# EAGLE board YAZ180_V23 (EAGLE 6.6.0), part 1 of 2
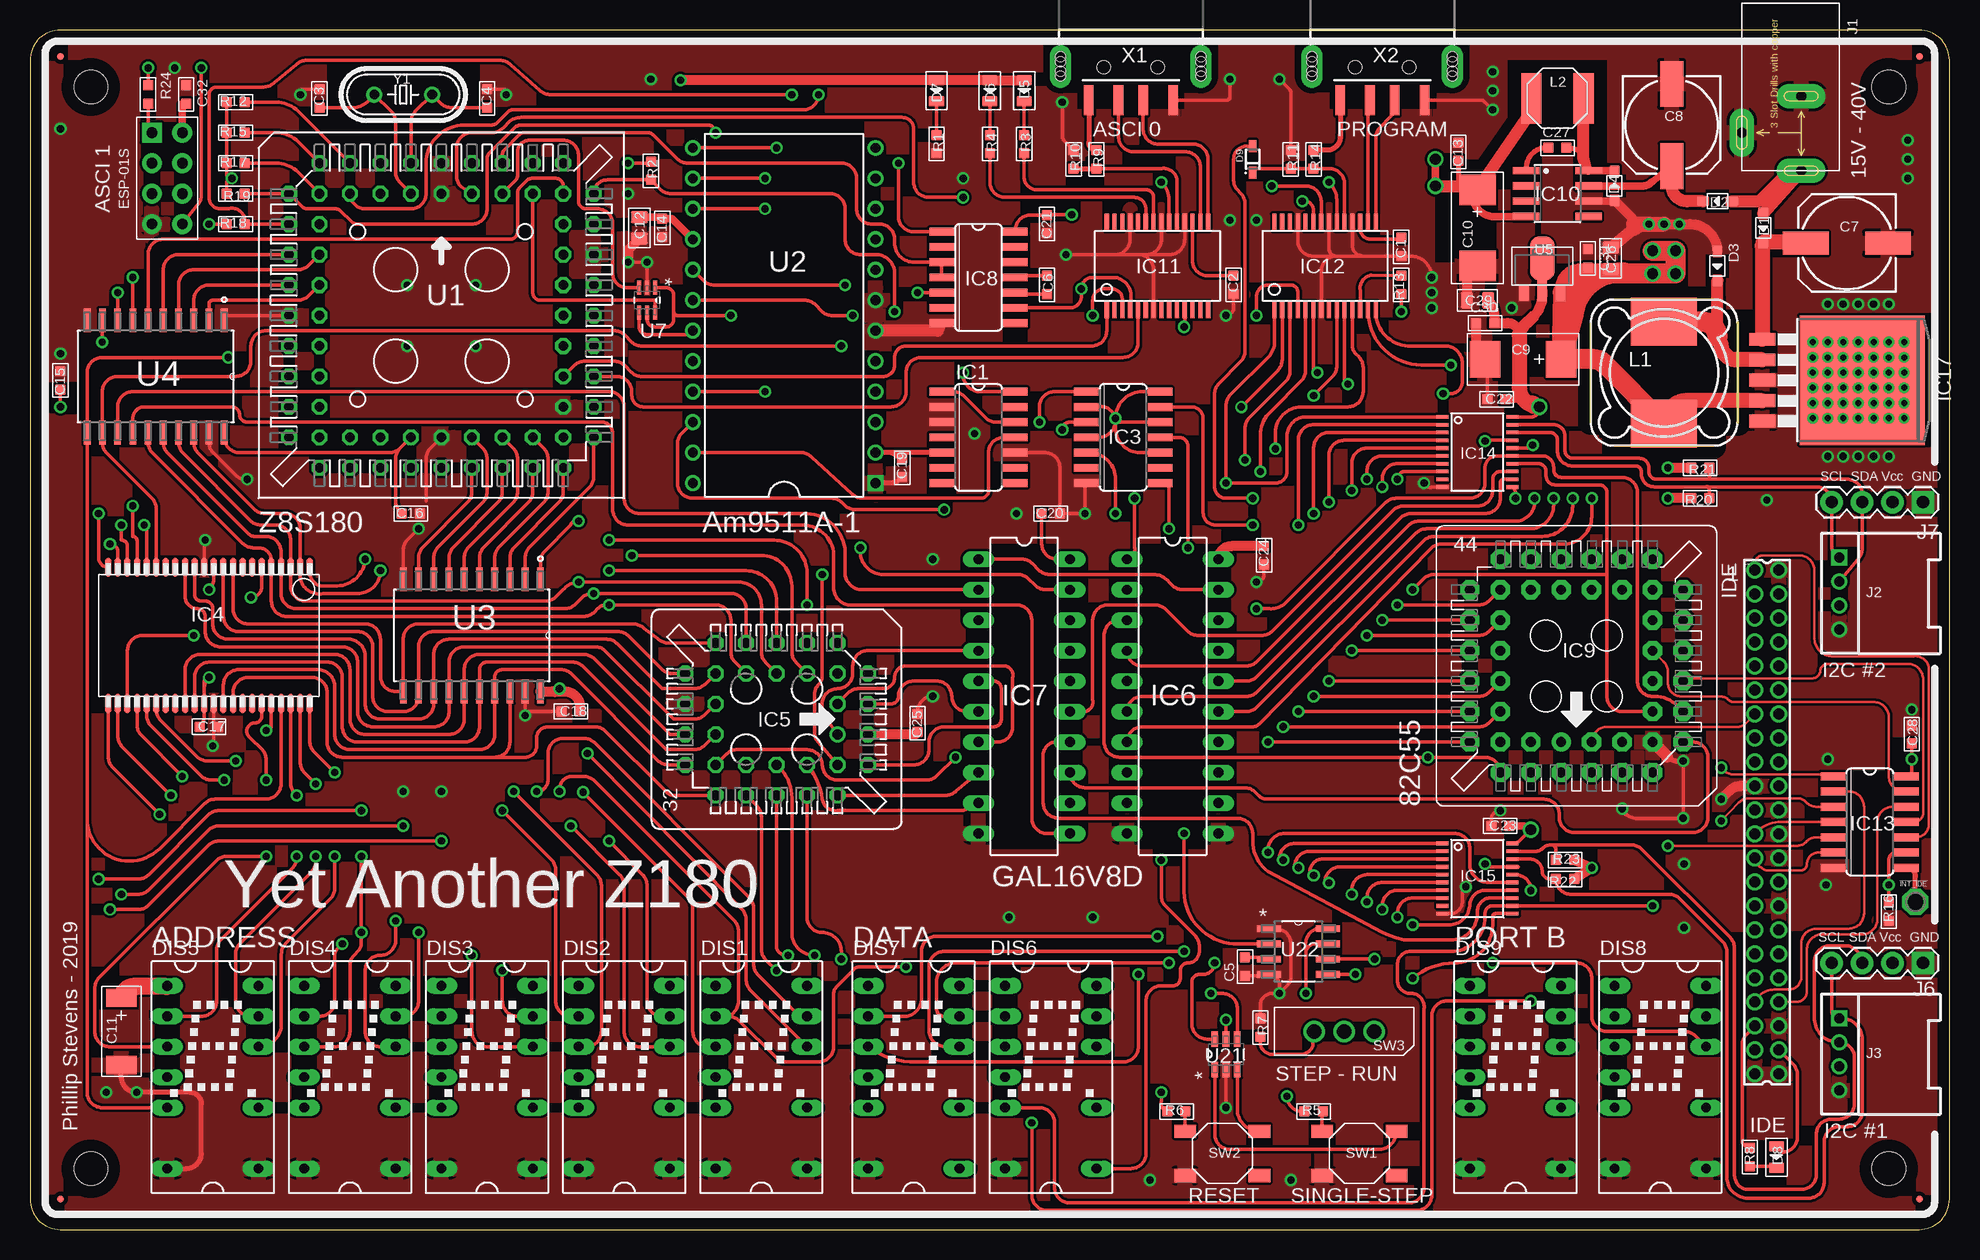
[diagram p7: board, top side]
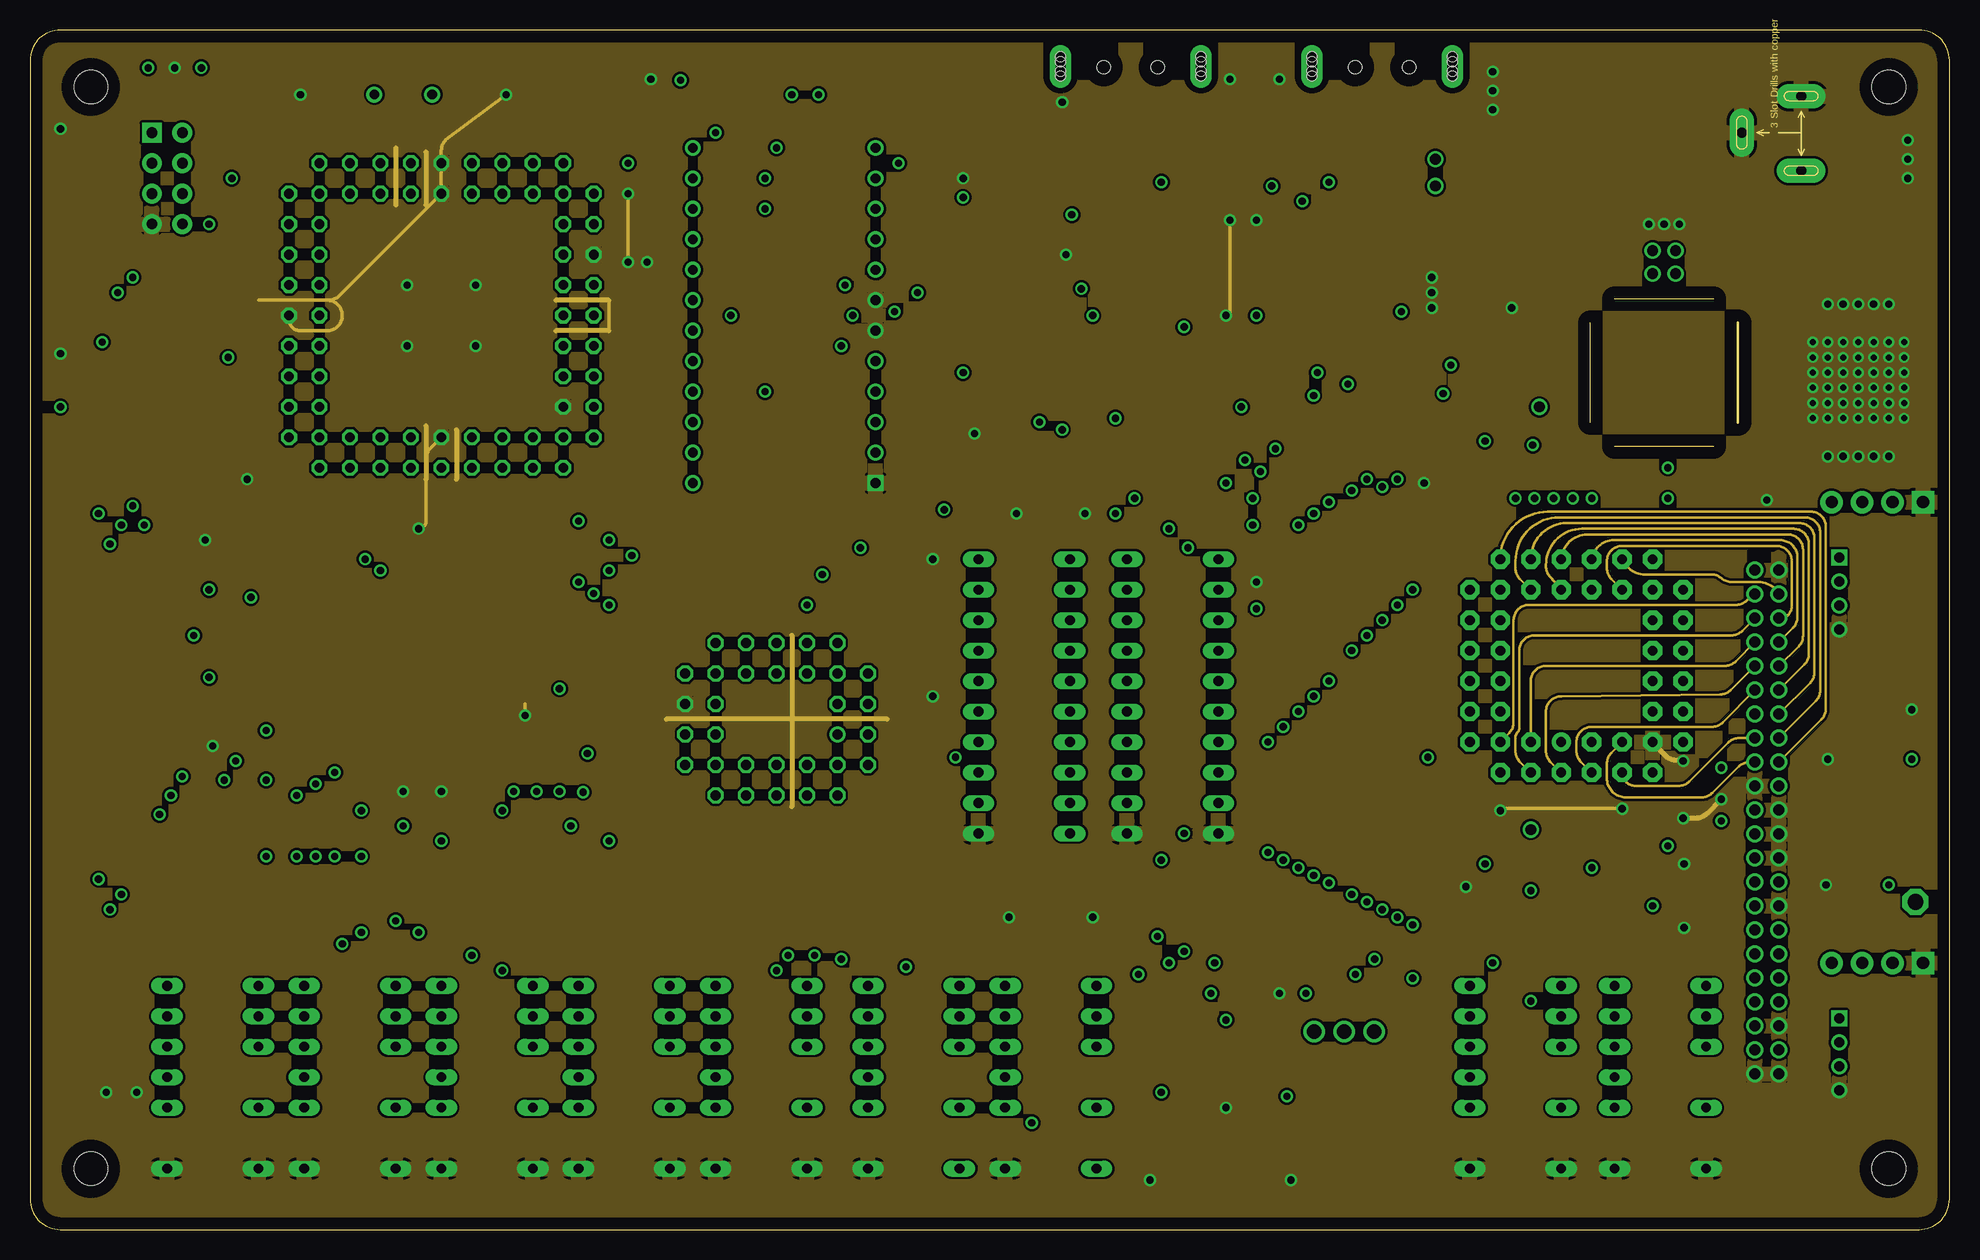
[diagram p8: board, inner layer $GND]
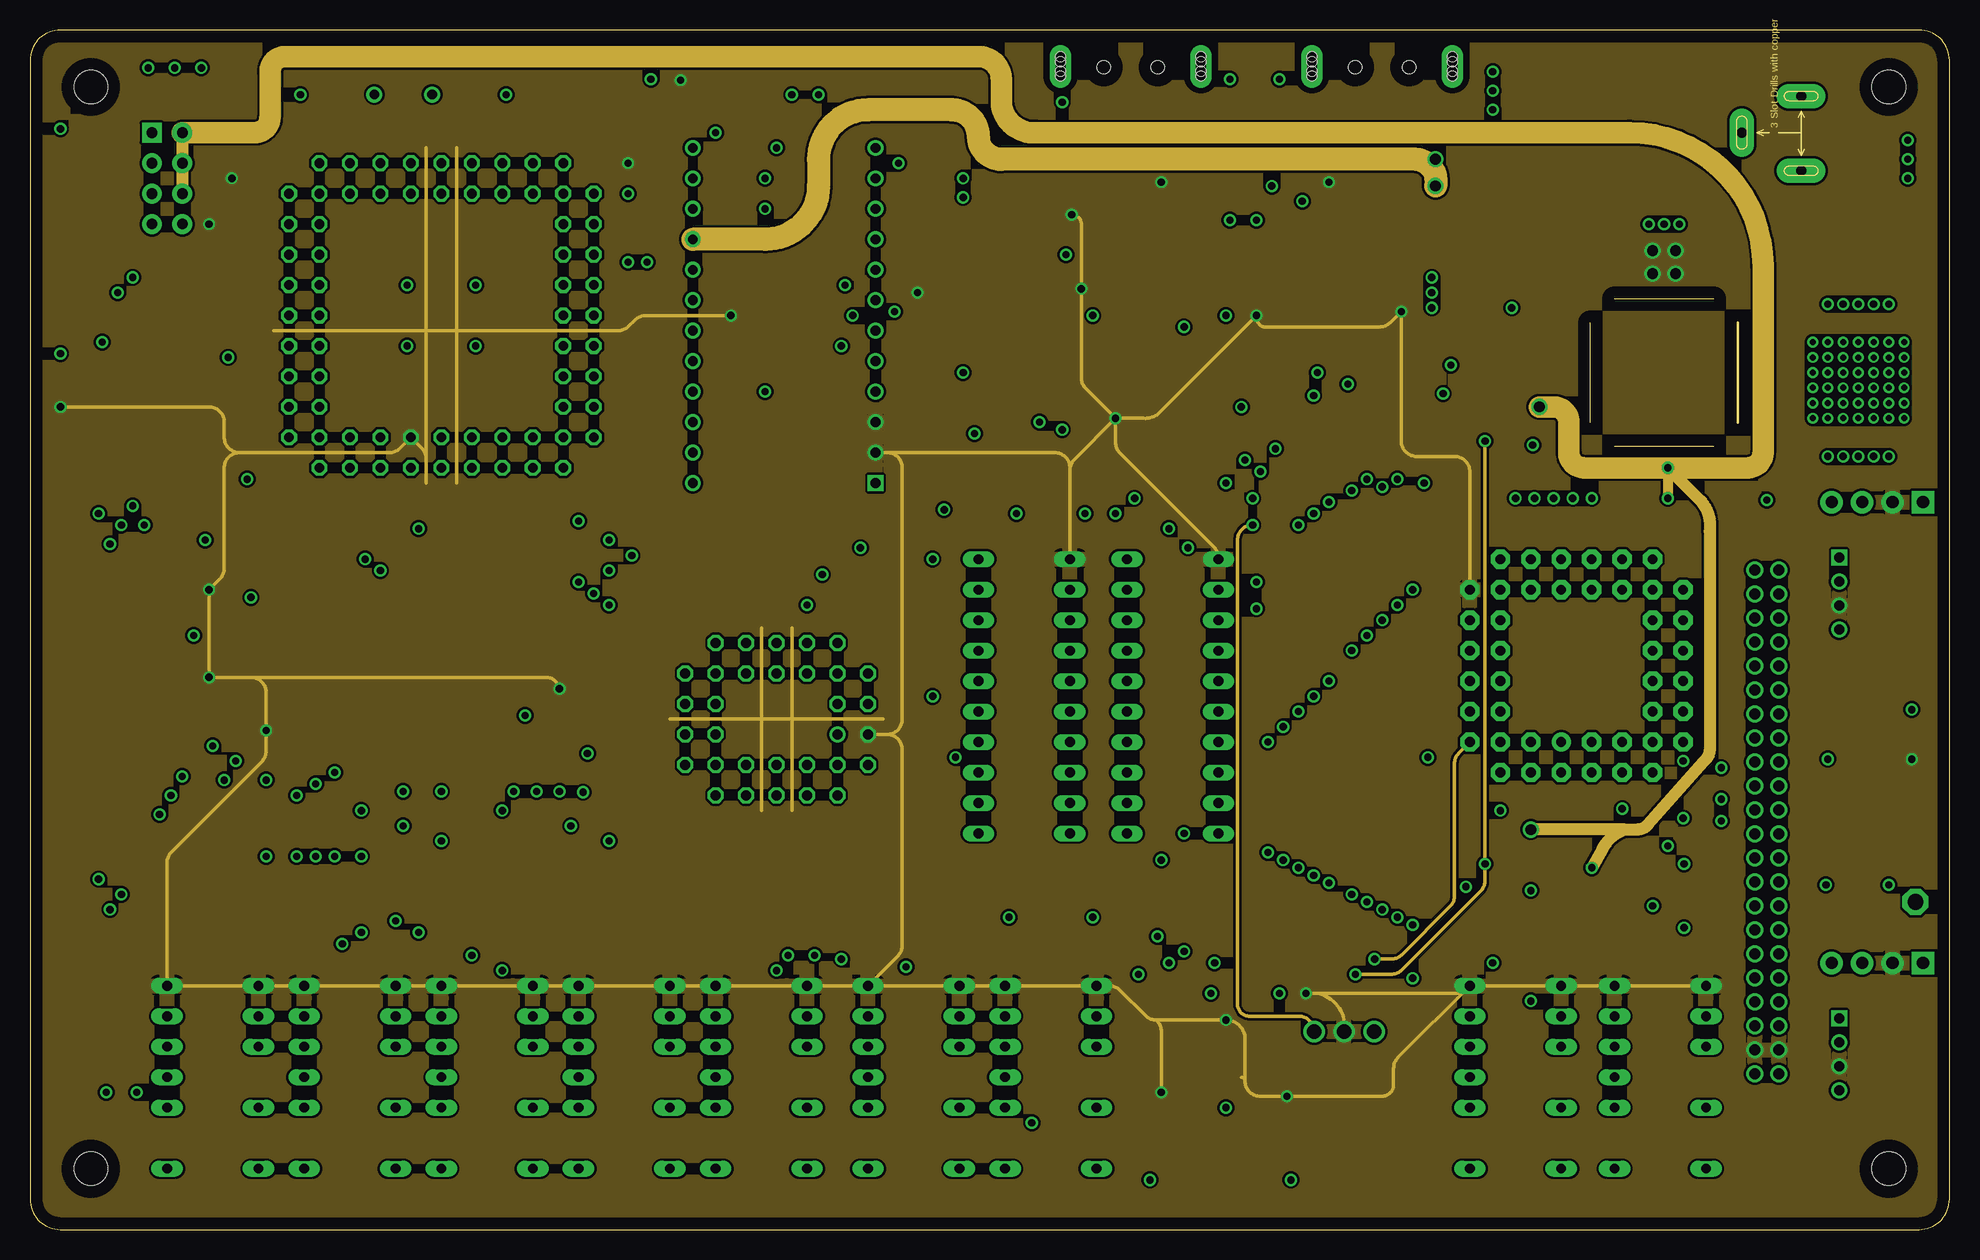
[diagram p9: board, inner layer $VCC]
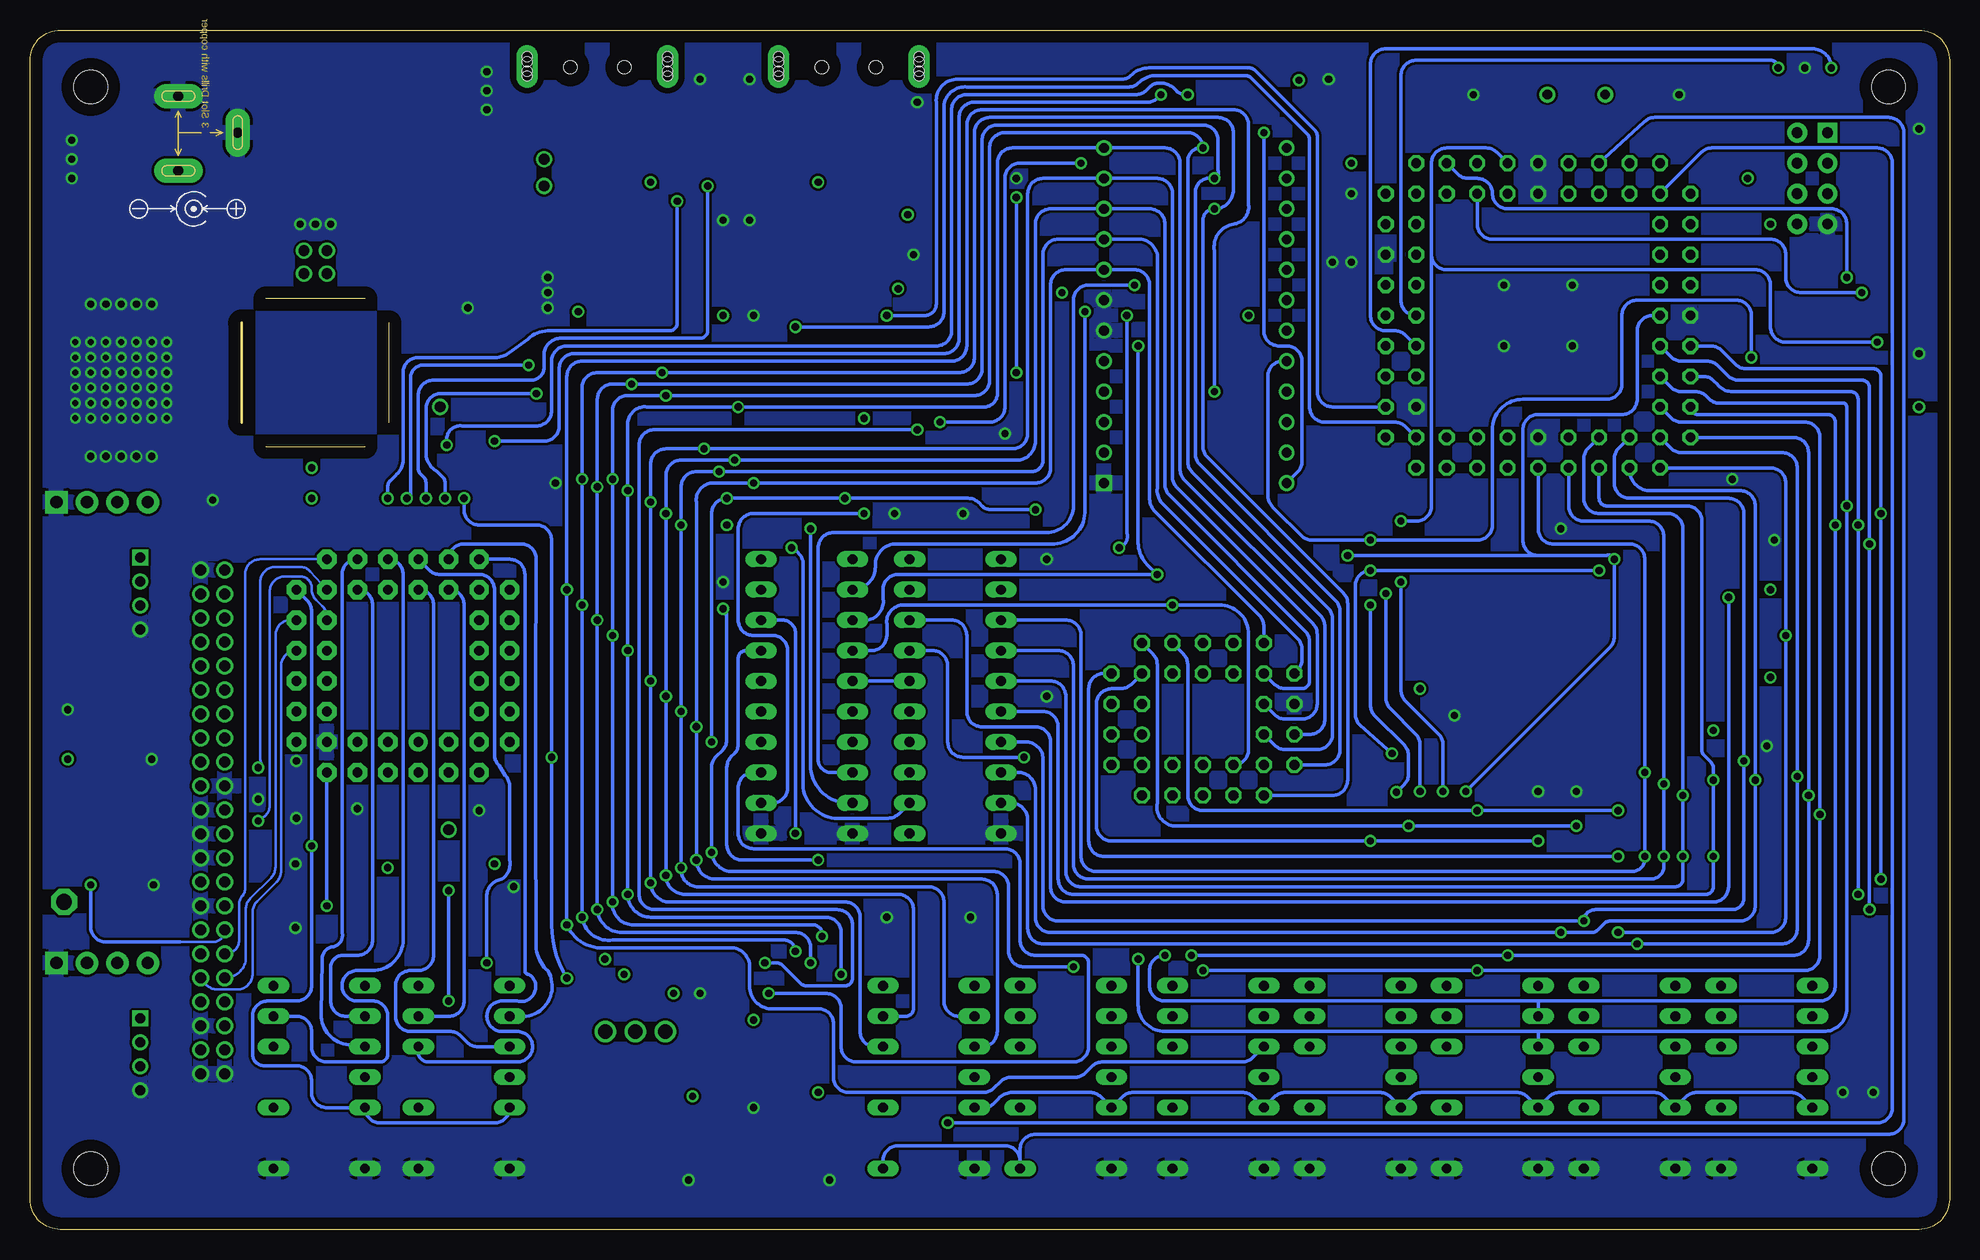
[diagram p10: board, bottom side, seen from below]

Size 160 x 100 mm. Coordinates in mm from the lower left corner, seen from the top.
Outline: 0,97.46 0,2.54 arc90 2.54,0 157.46,0 arc90 160,2.54 160,97.46 arc90 157.46,100 2.54,100 arc90 0,97.46
Copper layers (1*2*15*16): Top 0.035mm / dielectric 0.3mm / $GND 0.035mm / dielectric 0.3mm / $VCC 0.035mm / dielectric 0.3mm / Bottom 0.035mm
Design rules "default *": minimum track width 8mil, minimum drill 12mil, track to track 8mil, track to pad 8mil, pad to pad 8mil, via to via 10mil, smd to smd 8mil, copper to edge 40mil, drill to drill 8mil, minimum pad ring 10mil, minimum via ring 8mil, stop-mask expansion 4mil, vias tented up to drill 0mil, thermal gap 10mil
Holes 2.8 mm at 5.08,5.08 154.94,5.08 154.94,95.25 5.08,95.25
tRestrict: area 24.8,91.4 to 37.5,97.2; area 24.8,89.5 to 37.5,95.2; area 119.1,81.6 to 122.2,85.4; area 123.2,91.1 to 131.4,97.5; area 120.1,86.7 to 125.9,93.3; area 130.2,89.2 to 131.4,91.1; area 117.2,80.6 to 118.7,86; area 139.7,84.8 to 141.6,86.7; area 143.5,82.5 to 145.4,84.5; area 80,31.8 to 85.7,57.2; area 92.4,31.8 to 98.1,57.2; area 56.2,61 to 69.5,91.4; 13 more areas

## Footprints (pad centres in the part's own frame; a part is rotated, then mirrored left to right if it is on the bottom)
P1-13 = drill 1.321 pad 2.159 octagon: TP 0,0
C0603 = smd 0.889 x 0.889: 1 0,0.762; 2 0,-0.762
ELECTRO-SMD-E-7.8MM = smd 3.81 x 1.905: + 3.429,0; - -3.429,0
AVX-E = smd 2.54 x 3.048: + -3.175,0; - 3.175,0
AVX-C = smd 1.524 x 2.54: + -2.794,0; - 2.794,0
C0805 = smd 1.397 x 1.016: 1 0,0.889; 2 0,-0.889
SOD-323 = smd 1 x 0.8: + -1.2,0; - 1.2,0
LED-0805 = smd 0.889 x 1.27: + -0.889,0; - 0.889,0
SOD323F = smd 1 x 0.6: A 1.1,0; C -1.1,0
HTIL311A = drill 0.813 long: 1 -3.81,7.62; 2 -3.81,5.08; 3 -3.81,2.54; 4 -3.81,0; 5 -3.81,-2.54; 7 -3.81,-7.62; 8 3.81,-7.62; 10 3.81,-2.54; 12 3.81,2.54; 13 3.81,5.08; 14 3.81,7.62
H2X4-2.54 = drill 0.889 pad 1.651 square: 1 -1.27,3.81 | drill 0.889 pad 1.651: 2 -1.27,1.27; 3 -1.27,-1.27; 4 -1.27,-3.81; 5 1.27,-3.81; 6 1.27,-1.27; 7 1.27,1.27; 8 1.27,3.81
SO14 = smd 0.66 x 2.032: 1 -3.81,-3.073; 2 -2.54,-3.073; 3 -1.27,-3.073; 4 0,-3.073; 5 1.27,-3.073; 6 2.54,-3.073; 7 3.81,-3.073; 8 3.81,3.073; 9 2.54,3.073; 10 1.27,3.073; 11 0,3.073; 12 -1.27,3.073; 13 -2.54,3.073; 14 -3.81,3.073
TSOP-II-44 = smd 0.55 x 1.6: 1 -8.4,-5.68; 2 -7.6,-5.68; 3 -6.8,-5.68; 4 -6,-5.68; 5 -5.2,-5.68; 6 -4.4,-5.68; 7 -3.6,-5.68; 8 -2.8,-5.68; 9 -2,-5.68; 10 -1.2,-5.68; 11 -0.4,-5.68; 12 0.4,-5.68; 13 1.2,-5.68; 14 2,-5.68; 15 2.8,-5.68; 16 3.6,-5.68; 17 4.4,-5.68; 18 5.2,-5.68; 19 6,-5.68; 20 6.8,-5.68; 21 7.6,-5.68; 22 8.4,-5.68; 23 8.4,5.68; 24 7.6,5.68; 25 6.8,5.68; 26 6,5.68; 27 5.2,5.68; 28 4.4,5.68; 29 3.6,5.68; 30 2.8,5.68; 31 2,5.68; 32 1.2,5.68; 33 0.4,5.68; 34 -0.4,5.68; 35 -1.2,5.68; 36 -2,5.68; 37 -2.8,5.68; 38 -3.6,5.68; 39 -4.4,5.68; 40 -5.2,5.68; 41 -6,5.68; 42 -6.8,5.68; 43 -7.6,5.68; 44 -8.4,5.68
S32 = drill 0.813: 1 1.27,5.08 | drill 0.813 octagon: 2 -1.27,7.62; 3 -1.27,5.08; 4 -3.81,7.62; 5 -6.35,5.08; 6 -3.81,5.08; 7 -6.35,2.54; 8 -3.81,2.54; 9 -6.35,0; 10 -3.81,0; 11 -6.35,-2.54; 12 -3.81,-2.54; 13 -6.35,-5.08; 14 -3.81,-7.62; 15 -3.81,-5.08; 16 -1.27,-7.62; 17 -1.27,-5.08; 18 1.27,-7.62; 19 1.27,-5.08; 20 3.81,-7.62; 21 6.35,-5.08; 22 3.81,-5.08; 23 6.35,-2.54; 24 3.81,-2.54; 25 6.35,0; 26 3.81,0; 27 6.35,2.54; 28 3.81,2.54; 29 6.35,5.08; 30 3.81,7.62; 31 3.81,5.08; 32 1.27,7.62
DIL20 = drill 0.813 long: 1 -11.43,-3.81; 2 -8.89,-3.81; 3 -6.35,-3.81; 4 -3.81,-3.81; 5 -1.27,-3.81; 6 1.27,-3.81; 7 3.81,-3.81; 8 6.35,-3.81; 9 8.89,-3.81; 10 11.43,-3.81; 11 11.43,3.81; 12 8.89,3.81; 13 6.35,3.81; 14 3.81,3.81; 15 1.27,3.81; 16 -1.27,3.81; 17 -3.81,3.81; 18 -6.35,3.81; 19 -8.89,3.81; 20 -11.43,3.81
S44 = drill 0.813 pad 1.6: 1 1.27,6.35 | drill 0.813 pad 1.6 octagon: 2 -1.27,8.89; 3 -1.27,6.35; 4 -3.81,8.89; 5 -3.81,6.35; 6 -6.35,8.89; 7 -8.89,6.35; 8 -6.35,6.35; 9 -8.89,3.81; 10 -6.35,3.81; 11 -8.89,1.27; 12 -6.35,1.27; 13 -8.89,-1.27; 14 -6.35,-1.27; 15 -8.89,-3.81; 16 -6.35,-3.81; 17 -8.89,-6.35; 18 -6.35,-8.89; 19 -6.35,-6.35; 20 -3.81,-8.89; 21 -3.81,-6.35; 22 -1.27,-8.89; 23 -1.27,-6.35; 24 1.27,-8.89; 25 1.27,-6.35; 26 3.81,-8.89; 27 3.81,-6.35; 28 6.35,-8.89; 29 8.89,-6.35; 30 6.35,-6.35; 31 8.89,-3.81; 32 6.35,-3.81; 33 8.89,-1.27; 34 6.35,-1.27; 35 8.89,1.27; 36 6.35,1.27; 37 8.89,3.81; 38 6.35,3.81; 39 8.89,6.35; 40 6.35,8.89; 41 6.35,6.35; 42 3.81,8.89; 43 3.81,6.35; 44 1.27,8.89
SO08 = smd 0.6 x 2.2: 1 -1.905,-2.6; 2 -0.635,-2.6; 3 0.635,-2.6; 4 1.905,-2.6; 5 1.905,2.6; 6 0.635,2.6; 7 -0.635,2.6; 8 -1.905,2.6
SSOP28DB = smd 0.348 x 1.397: 1 -4.225,-3.656; 2 -3.575,-3.656; 3 -2.925,-3.656; 4 -2.275,-3.656; 5 -1.625,-3.656; 6 -0.975,-3.656; 7 -0.325,-3.656; 8 0.325,-3.656; 9 0.975,-3.656; 10 1.625,-3.656; 11 2.275,-3.656; 12 2.925,-3.656; 13 3.575,-3.656; 14 4.225,-3.656; 15 4.225,3.656; 16 3.575,3.656; 17 2.925,3.656; 18 2.275,3.656; 19 1.625,3.656; 20 0.975,3.656; 21 0.325,3.656; 22 -0.325,3.656; 23 -0.975,3.656; 24 -1.625,3.656; 25 -2.275,3.656; 26 -2.925,3.656; 27 -3.575,3.656; 28 -4.225,3.656
TSSOP20 = smd 0.305 x 0.991: 1 -2.975,-2.918; 2 -2.325,-2.918; 3 -1.675,-2.918; 4 -1.025,-2.918; 5 -0.375,-2.918; 6 0.275,-2.918; 7 0.925,-2.918; 8 1.575,-2.918; 9 2.225,-2.918; 10 2.875,-2.918; 11 2.875,2.918; 12 2.225,2.918; 13 1.575,2.918; 14 0.925,2.918; 15 0.275,2.918; 16 -0.375,2.918; 17 -1.025,2.918; 18 -1.675,2.918; 19 -2.325,2.918; 20 -2.975,2.918
TO263-5 = smd 1.067 x 2.159: 1 -3.404,-5.791; 2 -1.702,-5.791; 3 0,-5.791; 4 1.702,-5.791; 5 3.404,-5.791 | smd 10.8 x 10.41: 6 0,2.54
87758-4416 = drill 0.9 pad 1.27: 1 -21,-1; 2 -21,1; 3 -19,-1; 4 -19,1; 5 -17,-1; 6 -17,1; 7 -15,-1; 8 -15,1; 9 -13,-1; 10 -13,1; 11 -11,-1; 12 -11,1; 13 -9,-1; 14 -9,1; 15 -7,-1; 16 -7,1; 17 -5,-1; 18 -5,1; 19 -3,-1; 20 -3,1; 21 -1,-1; 22 -1,1; 23 1,-1; 24 1,1; 25 3,-1; 26 3,1; 27 5,-1; 28 5,1; 29 7,-1; 30 7,1; 31 9,-1; 32 9,1; 33 11,-1; 34 11,1; 35 13,-1; 36 13,1; 37 15,-1; 38 15,1; 39 17,-1; 40 17,1; 41 19,-1; 42 19,1; 43 21,-1; 44 21,1
DCJ3P-14.2X11.0X9.0MM = drill 0.813 pad 2.032 long: + 3.175,0; -1 -3.048,0; -2 0,-4.953
HW4-2.0-90D = drill 0.8 pad 1.27 square: 1 -3,0 | drill 0.8 pad 1.27: 2 -1,0; 3 1,0; 4 3,0
1X04 = drill 1.016 pad 1.88 square: 1 0,0 | drill 1.016 pad 1.88: 2 2.54,0; 3 5.08,0; 4 7.62,0
MSS1260 = smd 5.5 x 4: P$1 0,4.25; P$2 0,-4.25
SMD-2P-5.0X5.0X2.0MM = smd 4.2 x 1.7: 1 0,2.175; 2 0,-2.175
R0603 = smd 0.889 x 0.889: 1 0,0.762; 2 0,-0.762
SW4-SMD-4.0X4.0X1.7MM = smd 1.8 x 1.1: 1 -3.1,1.85; 2 3.1,1.85; 3 -3.1,-1.85; 4 3.1,-1.85
SW3-2.5-11.6X4.0X5.4+2.0MM = drill 1.2: 1 -2.5,0; 2 0,0; 3 2.5,0
PLCC-S68 = drill 0.813 octagon: 1 0,12.7; 2 0,10.16; 3 -2.54,12.7; 4 -2.54,10.16; 5 -5.08,12.7; 6 -5.08,10.16; 7 -7.62,12.7; 8 -7.62,10.16; 9 -10.16,12.7; 10 -12.7,10.16; 11 -10.16,10.16; 12 -12.7,7.62; 13 -10.16,7.62; 14 -12.7,5.08; 15 -10.16,5.08; 16 -12.7,2.54; 17 -10.16,2.54; 18 -12.7,0; 19 -10.16,0; 20 -12.7,-2.54; 21 -10.16,-2.54; 22 -12.7,-5.08; 23 -10.16,-5.08; 24 -12.7,-7.62; 25 -10.16,-7.62; 26 -12.7,-10.16; 27 -10.16,-12.7; 28 -10.16,-10.16; 29 -7.62,-12.7; 30 -7.62,-10.16; 31 -5.08,-12.7; 32 -5.08,-10.16; 33 -2.54,-12.7; 34 -2.54,-10.16; 35 0,-12.7; 36 0,-10.16; 37 2.54,-12.7; 38 2.54,-10.16; 39 5.08,-12.7; 40 5.08,-10.16; 41 7.62,-12.7; 42 7.62,-10.16; 43 10.16,-12.7; 44 12.7,-10.16; 45 10.16,-10.16; 46 12.7,-7.62; 47 10.16,-7.62; 48 12.7,-5.08; 49 10.16,-5.08; 50 12.7,-2.54; 51 10.16,-2.54; 52 12.7,0; 53 10.16,0; 54 12.7,2.54; 55 10.16,2.54; 56 12.7,5.08; 57 10.16,5.08; 58 12.7,7.62; 59 10.16,7.62; 60 12.7,10.16; 61 10.16,12.7; 62 10.16,10.16; 63 7.62,12.7; 64 7.62,10.16; 65 5.08,12.7; 66 5.08,10.16; 67 2.54,12.7; 68 2.54,10.16
DIL24-6 = drill 0.813 square: 1 -13.97,-7.62 | drill 0.813: 2 -11.43,-7.62; 3 -8.89,-7.62; 4 -6.35,-7.62; 5 -3.81,-7.62; 6 -1.27,-7.62; 7 1.27,-7.62; 8 3.81,-7.62; 9 6.35,-7.62; 10 8.89,-7.62; 11 11.43,-7.62; 12 13.97,-7.62; 13 13.97,7.62; 14 11.43,7.62; 15 8.89,7.62; 16 6.35,7.62; 17 3.81,7.62; 18 1.27,7.62; 19 -1.27,7.62; 20 -3.81,7.62; 21 -6.35,7.62; 22 -8.89,7.62; 23 -11.43,7.62; 24 -13.97,7.62
SOIC127P1030X265-20N = smd 1.981 x 0.559: 1 -4.674,5.715; 2 -4.674,4.445; 3 -4.674,3.175; 4 -4.674,1.905; 5 -4.674,0.635; 6 -4.674,-0.635; 7 -4.674,-1.905; 8 -4.674,-3.175; 9 -4.674,-4.445; 10 -4.674,-5.715; 11 4.674,-5.715; 12 4.674,-4.445; 13 4.674,-3.175; 14 4.674,-1.905; 15 4.674,-0.635; 16 4.674,0.635; 17 4.674,1.905; 18 4.674,3.175; 19 4.674,4.445; 20 4.674,5.715
SOT89 = smd 0.8 x 1.4: 1 -1.524,-1.905; 3 1.524,-1.905 | smd 0.8 x 1.9: 2 0,-1.651 | smd 2.032 x 3.65: 4 0,0.94
SOT65P210X110-6N = smd 1.168 x 0.356: 1 -1.041,0.66; 2 -1.041,0; 3 -1.041,-0.66; 4 1.041,-0.66; 5 1.041,0; 6 1.041,0.66
SOT95P280X145-6N = smd 1.321 x 0.559: 1 -1.27,0.94; 2 -1.27,0; 3 -1.27,-0.94; 4 1.27,-0.94; 5 1.27,0; 6 1.27,0.94
SOIC127P600X175-8N = smd 1.981 x 0.559: 1 -2.464,1.905; 2 -2.464,0.635; 3 -2.464,-0.635; 4 -2.464,-1.905; 5 2.464,-1.905; 6 2.464,-0.635; 7 2.464,0.635; 8 2.464,1.905
USB-A-SMT-MALE = smd 0.8 x 2.5: D+1 1.027,-5.87; D-1 -1.027,-5.87; GND1 3.551,-5.87; VBUS1 -3.5,-5.87 | drill 0.8 pad 1.778 long: P$1 5.85,-3.05; P$3 -5.85,-3.05 | hole 1.1: 2.25,-3.12; -2.25,-3.12 | hole 0.8: -5.85,-3.45; -5.85,-3.85; -5.85,-2.65; -5.85,-2.25; 5.85,-3.45; 5.85,-3.85; 5.85,-2.65; 5.85,-2.25
FIDUCIAL0.6-1.2 = smd 0.6 x 0.6: 1 0,0
HC49US = drill 0.813: 1 -2.413,0; 2 2.413,0

## Placement (x,y rotation side)
!INT_IDE  TPSPAD1-13  [P1-13]  157.16,27.3 0 top
C1  100nf  [C0603]  114.3,81.92 180 top
C2  100nf  [C0603]  100.33,78.74 180 top
C3  22pf  [C0603]  24.13,94.3 0 top
C4  22pf  [C0603]  38.1,94.3 0 top
C5  2.2uf  [C0603]  101.28,21.91 180 top
C6  22pf  [C0603]  84.77,78.74 0 top
C7  100uf  [ELECTRO-SMD-E-7.8MM]  151.45,82.23 180 top
C8  100uf  [ELECTRO-SMD-E-7.8MM]  136.84,92.08 270 top
C9  220uf  [AVX-E]  124.46,72.55 180 top
C10  220uf  [AVX-E]  120.65,83.5 270 top
C11  100uf  [AVX-C]  7.62,16.51 270 top
C12  10uf  [C0805]  50.8,83.5 0 top
C13  100nf  [C0603]  119.06,89.85 0 top
C14  100nf  [C0603]  52.7,83.5 180 top
C15  100nf  [C0603]  2.54,70.8 0 top
C16  100nf  [C0603]  31.75,59.69 270 top
C17  100nf  [C0603]  14.92,41.91 270 top
C18  100nf  [C0603]  45.09,43.18 90 top
C19  100nf  [C0603]  72.71,63.5 180 top
C20  100nf  [C0603]  85.09,59.69 270 top
C21  100nf  [C0603]  84.77,83.82 180 top
C22  100nf  [C0603]  122.24,69.22 90 top
C23  100nf  [C0603]  122.56,33.66 90 top
C24  100nf  [C0603]  102.87,56.2 180 top
C25  100nf  [C0603]  73.98,42.23 0 top
C26  10uf  [C0805]  131.76,80.96 180 top
C27  10nf  [C0603]  127.32,90.17 90 top
C28  100nf  [C0603]  156.84,41.27 0 top
C29  10uf  [C0805]  120.65,77.47 270 top
C30  100nf  [C0603]  121.28,75.56 90 top
C31  100nf  [C0603]  129.86,80.96 0 top
C32  100nf  [C0603]  13.02,94.61 0 top
D1  60V-3A  [SOD-323]  144.46,83.5 270 top
D2  60V-1A  [SOD-323]  140.65,85.72 180 top
D3  60V-3A  [SOD-323]  140.65,80.33 270 top
D4  60V-1A  [SOD-323]  132.08,87 90 top
D5  SMD-LED-CLEAR-YELLOW(0805)  [LED-0805]  82.87,94.93 270 top
D6  SMD-LED-CLEAR-GREEN(0805)  [LED-0805]  80.01,94.93 270 top
D7  SMD-LED-CLEAR-RED(0805)  [LED-0805]  75.56,94.93 270 top
D8  SMD-LED-CLEAR-RED(0805)  [LED-0805]  145.57,6.03 270 top
D9  1N4148WS  [SOD323F]  101.92,89.22 90 top
DIS1  HTIL311A  [HTIL311A]  60.96,12.7 0 top
DIS2  HTIL311A  [HTIL311A]  49.53,12.7 0 top
DIS3  HTIL311A  [HTIL311A]  38.1,12.7 0 top
DIS4  HTIL311A  [HTIL311A]  26.67,12.7 0 top
DIS5  HTIL311A  [HTIL311A]  15.24,12.7 0 top
DIS6  HTIL311A  [HTIL311A]  85.09,12.7 0 top
DIS7  HTIL311A  [HTIL311A]  73.66,12.7 0 top
DIS8  HTIL311A  [HTIL311A]  135.89,12.7 0 top
DIS9  HTIL311A  [HTIL311A]  123.83,12.7 0 top
ESP-01S  ESP-01S  [H2X4-2.54]  11.43,87.63 0 top
IC1  74LS93D  [SO14]  79.06,66.04 270 top
IC3  74ACT74D  [SO14]  91.12,66.04 270 top
IC4  IS62WV10248DALL-55T  [TSOP-II-44]  14.92,49.53 180 top
IC5  SST39VF010  [S32]  62.23,42.55 270 top
IC6  ATF16V8BP3  [DIL20]  95.25,44.45 270 top
IC7  ATF16V8BP3  [DIL20]  82.87,44.45 270 top
IC8  74121D  [SO14]  79.06,79.38 270 top
IC9  82c55  [S44]  128.91,46.99 180 top
IC10  LM2674AM-12V  [SO08]  127.32,86.36 270 top
IC11  FT232RL  [SSOP28DB]  93.98,80.33 0 top
IC12  FT245RL  [SSOP28DB]  107.95,80.33 0 top
IC13  74HCT04D  [SO14]  153.35,33.97 270 top
IC14  PCA9665  [TSSOP20]  120.65,64.77 270 top
IC15  PCA9665  [TSSOP20]  120.65,29.21 270 top
IC17  LM2596S-5V  [TO263-5]  150.18,70.8 270 top
IDE  87758-4416  [87758-4416]  144.78,33.97 270 top
J1  DC-005  [DCJ3P-14.2X11.0X9.0MM]  147.64,91.44 270 top
J2  I2C Grove 2  [HW4-2.0-90D]  150.81,53.02 270 top
J3  I2C Grove 1  [HW4-2.0-90D]  150.81,14.61 270 top
J6  I2C Pinout 1  [1X04]  157.8,22.23 180 top
J7  I2C Pinout 2  [1X04]  157.8,60.64 180 top
L1  33uH  [MSS1260]  136.21,71.44 0 top
L2  200UH  [SMD-2P-5.0X5.0X2.0MM]  127.32,94.3 270 top
R1  270R  [R0603]  75.56,90.49 180 top
R2  10K  [R0603]  51.75,88.27 0 top
R3  270R  [R0603]  82.87,90.49 180 top
R4  270R  [R0603]  80.01,90.49 180 top
R5  10K  [R0603]  107,9.84 270 top
R6  10K  [R0603]  95.57,9.84 270 top
R7  10K  [R0603]  102.55,16.83 180 top
R8  270R  [R0603]  143.35,6.03 0 top
R9  4.7K  [R0603]  88.9,89.22 180 top
R10  10K  [R0603]  87,89.22 0 top
R11  10K  [R0603]  105.09,89.22 0 top
R12  10K  [R0603]  17.14,93.98 90 top
R13  10K  [R0603]  114.3,78.74 0 top
R14  4.7K  [R0603]  107,89.22 180 top
R15  4.7K  [R0603]  17.14,91.44 90 top
R16  10K  [R0603]  154.94,26.51 180 top
R17  10K  [R0603]  17.14,88.9 90 top
R18  10K  [R0603]  17.14,83.82 90 top
R19  10K  [R0603]  17.14,86.36 90 top
R20  2.2K  [R0603]  139.22,60.96 270 top
R21  2.2K  [R0603]  139.22,63.5 270 top
R22  2.2K  [R0603]  127.95,29.21 90 top
R23  2.2K  [R0603]  127.95,30.8 90 top
R24  270R  [R0603]  9.84,94.61 180 top
SW1  SINGLE STEP  [SW4-SMD-4.0X4.0X1.7MM]  110.81,6.35 0 top
SW2  RESET  [SW4-SMD-4.0X4.0X1.7MM]  99.38,6.35 0 top
SW3  DIP-SLIDE-SWITCH(3P-11.6X4.0X5.4+2.0MM)-EG1218  [SW3-2.5-11.6X4.0X5.4+2.0MM]  109.54,16.51 180 top
U1  Z8X180PLCC68-S  [PLCC-S68]  34.29,76.2 0 top
U2  AM9511A-1  [DIL24-6]  62.87,76.2 90 top
U3  SN74ABTH245DW  [SOIC127P1030X265-20N]  36.83,49.53 270 top
U4  SN74ABT541BDW  [SOIC127P1030X265-20N]  10.48,71.12 270 top
U5  CJ1117-3.3-1310120P1  [SOT89]  126.05,80.01 0 top
U7  SN74LVC1G97DCKR  [SOT65P210X110-6N]  51.44,77.47 270 top
U21  MAX6817EUT+T  [SOT95P280X145-6N]  99.69,14.61 90 top
U22  TLC7705ID  [SOIC127P600X175-8N]  105.73,23.18 0 top
X1  ASCI0 - USB  [USB-A-SMT-MALE]  91.76,100.01 0 top
X2  USB Programmer  [USB-A-SMT-MALE]  112.71,100.01 0 top
X3  FIDUCIAL_0.6-1.2MM  [FIDUCIAL0.6-1.2]  2.54,97.79 0 top
X4  FIDUCIAL_0.6-1.2MM  [FIDUCIAL0.6-1.2]  157.48,97.79 0 top
X5  FIDUCIAL_0.6-1.2MM  [FIDUCIAL0.6-1.2]  2.54,2.54 0 top
X6  FIDUCIAL_0.6-1.2MM  [FIDUCIAL0.6-1.2]  157.48,2.54 0 top
Y1  18.432MHZ  [HC49US]  31.11,94.61 180 top

## Tracks (layer width: path | path; a pad name or v marks a point on that pad's centre or on a via)
3V3
  Top 0.305: IC12.17 110.88,83.44 arc90 111.76,82.55 114.17,82.55 arc90 C1.2
!ACT
  Top 0.305: R8.1 arc-90 142.72,7.43 142.72,15.38 arc-45 143.09,16.28 IDE.39
!BUSRQ
  Top 0.305: U1.7 22.33,93.24 arc45 20.54,93.98 R12.2
!CTS0  (via drill 0.6)
  Top 0.305: IC11.3 91.06,77.54 arc90 90.17,78.42 89.53,78.42 arc90 88.58,77.47 v88.58,76.2
  Bottom 0.305: U1.46 51.44,68.58 arc90 52.7,69.85 52.7,91.18 arc-45 52.89,91.63 57.92,96.65 arc-45 58.37,96.84 66.73,96.84 arc-45 68.26,96.2 arc45 69.03,95.89 82.87,95.89 arc-90 84.45,93.98 84.45,77.15 arc90 85.41,76.2 v88.58,76.2
!DCS0
  Top 0.203: IC13.2 151.61,36.51 arc-90 152.88,35.24 152.88,26.35 arc-90 151.61,25.08 148.91,25.08 arc90 147.64,23.81 147.64,20.95 arc-90 146.53,20 145.41,20 arc64 IDE.37
!DCS1
  Top 0.203: IC13.12 155.26,35.24 arc90 153.99,33.97 153.99,25.88 arc-90 152.72,24.61 149.38,24.61 arc90 148.11,23.34 148.11,19.84 arc-90 147.24,18.97 IDE.38
!DIO_CS
  Top 0.305: IC7.13 arc90 87.95,36.83 101.23,36.83 arc-45 102.13,36.46 102.39,36.2 arc45 103.16,35.88 126.21,35.88 arc-90 127.48,34.61 127.48,34.37 arc90 128.75,33.1 138.59,33.1 arc90 139.86,34.37 139.86,39.37 arc90 138.59,40.64 IC9.7
!DIOR
  Top 0.203: IC13.6 149.07,31.43 arc90 148.11,30.48 arc-90 147.56,29.92 144.86,29.92 arc-67 IDE.25
!DIOW
  Top 0.203: IC13.4 146.21,33.97 arc58 IDE.23
!DRESET
  Top 0.203: IDE.1 143.78,55.52 arc-90 144.46,56.2 147.48,56.2 arc-90 148.75,54.93 148.75,49.21 arc90 150.34,47.78 157,47.78 arc-90 158.27,46.83 158.27,33.97 arc-90 157.32,32.7 IC13.10
!FLASH_CS  (via drill 0.6)
  Top 0.305: IC5.22 58.05,39.63 arc-45 58.95,40.01 64.77,40.01 arc-90 66.04,38.73 arc90 67.31,37.47 74.72,37.47 arc45 75.62,37.84 v77.15,39.37
  Bottom 0.305: v77.15,39.37 82.23,39.37 arc90 83.5,40.64 83.5,46.99 arc-90 84.77,48.26 IC7.17
!FPU_CS  (via drill 0.6)
  Top 0.305: IC7.19 84.66,53.34 arc-45 83.77,53.71 83.24,54.24 arc45 82.34,54.61 71.12,54.61 arc-90 69.22,56.52 v69.22,56.83 | U2.18 64.56,77.47 arc-45 65.46,77.1 65.99,76.57 arc45 66.88,76.2 v68.58,76.2
  Bottom 0.305: v69.22,56.83 arc-90 68.58,58.1 v68.58,76.2
!FTDI0_RESET
  Top 0.305: R9.1 94.33,88.46 arc-90 95.61,87.5 IC11.19
  Top 0.406: R10.2 R9.1
!FTDI1_RESET
  Top 0.305: IC12.19 109.58,87.19 arc90 108.31,88.46 R14.1 R11.2 102.25,88.46 arc90 D9.C
!HALT  (via drill 0.6)
  Top 0.305: v72.07,76.52 72.07,79.69 arc90 70.48,81.28 69.22,81.28 arc-90 67.94,82.55 67.94,85.09 arc90 66.67,86.36 53.42,86.36 arc-45 52.52,86.73 R2.2 48.13,87.5 arc90 U1.60
  Bottom 0.305: v72.07,76.52 72.07,60.01 arc90 74.61,57.15 87.63,57.15 arc-90 89.53,55.56 89.53,55.24 arc90 IC6.2
!I2C_CS1
  Top 0.305: IC15.13 121.61,27.64 arc90 120.65,26.35 arc-90 118.43,24.13 114.51,24.13 arc-5 112.71,24.77 103.19,29.84 arc-53 101.92,32.38 101.92,33.02 arc90 100.65,34.29 85.72,34.29 arc-90 84.45,35.56 84.45,39.37 arc-90 85.41,40.64 IC7.14
!I2C_CS2
  Top 0.305: IC7.15 87.95,43.18 arc90 88.58,44.13 88.58,50.8 arc-90 89.85,52.07 93.77,52.07 arc-45 94.67,51.7 96.47,49.9 arc45 97.36,49.53 102.66,49.53 arc45 103.56,49.9 113.61,59.95 arc-45 114.51,60.33 120.65,60.33 arc90 121.92,61.59 121.92,62.55 arc-90 122.57,63.2 IC14.13
!INT0  (via drill 0.6)
  Top 0.305: v57.15,91.44 arc90 56.52,92.08 40.9,92.08 arc45 40.45,91.89 38.29,89.72 arc45 38.1,89.27 38.1,85.09 arc-90 36.83,83.82 27.25,83.82 arc-45 26.8,84.01 25.9,84.9 arc45 25.45,85.09 23.12,85.09 arc-45 22.67,85.28 U1.10 R19.2
  Bottom 0.305: v57.15,91.44 57.15,74.93 arc-90 55.88,73.66 55.24,73.66 arc90 53.98,72.39 53.98,64.03 arc45 54.35,63.13 U2.24
!INT1  (via drill 0.6)
  Top 0.305: v125.09,28.26 125.09,28.32 arc90 123.83,29.59 IC15.16 | v125.09,19.05 118.11,19.05 arc90 116.84,17.78 116.84,2.86 arc-90 115.57,1.59 84.77,1.59 arc-90 83.5,2.86 v83.5,8.89 | U1.11 22.33,88.16 arc45 20.54,88.9 R17.2
  Bottom 0.305: v83.5,8.89 6.03,8.89 arc-90 4.76,10.16 4.76,88.9 arc-90 6.03,90.17 19.79,90.17 arc-45 20.69,89.8 U1.11 | v125.09,19.05 v125.09,28.26
!INT2  (via drill 0.6)
  Top 0.305: IC14.16 124.83,65.14 arc90 v125.25,65.41 | v63.5,94.61 43.39,94.61 arc-45 42.49,94.99 40.06,97.1 arc45 39.16,97.47 23.07,97.47 arc45 22.17,97.1 20.37,95.62 arc-45 19.48,95.25 15.56,95.25 arc90 14.92,94.61 14.92,86.04 arc90 15.88,85.09 16.51,85.09 arc-118 R18.2 U1.12
  Bottom 0.305: v125.25,65.41 125.25,66.04 arc90 123.98,66.99 117.79,66.99 arc-90 116.52,68.26 116.52,72.39 arc90 115.25,73.66 84.45,73.66 arc-90 83.19,74.93 83.19,93.34 arc90 81.92,94.61 67.84,94.61 arc-45 66.94,94.99 66.67,95.25 arc45 65.91,95.57 arc45 64.73,95.21 64.45,94.93 arc-45 63.69,94.61 v63.5,94.61
!INT_IDE
  Top 0.406: !INT_IDE.TP 157.16,29.43 arc90 IC13.8
!IORQ
  Top 0.305: IC7.11 84.77,33.02 arc-90 83.5,34.29 83.5,50.8 arc90 82.23,52.07 68.58,52.07 arc-90 66.99,53.34 66.99,56.52 arc77 64.45,58.74 49.85,58.74 arc-90 48.58,60.01 48.58,66.36 arc90 47.62,67.31 18.1,67.31 arc-90 17.46,67.94 arc90 16.83,68.58 9.53,68.58 arc90 8.57,67.63 U4.14
!M1
  Top 0.305: IC8.4 IC8.3 73.66,80.64 arc-90 72.07,82.23 72.07,82.55 arc90 70.8,83.82 70.17,83.82 arc-90 68.9,85.09 68.9,87.63 arc90 67.63,88.9 54.82,88.9 arc-45 53.92,89.27 51.94,91.25 arc45 51.49,91.44 41.22,91.44 arc45 40.77,91.25 39.56,90.04 arc45 39.37,89.59 U1.65
!MREQ
  Top 0.305: IC7.2 69.22,53.34 arc-90 67.94,54.93 67.94,56.2 arc90 64.77,59.69 50.8,59.69 arc-90 49.53,60.96 49.53,68.58 arc90 48.26,69.85 8.57,69.85 arc90 7.3,68.58 U4.13
!NMI
  Top 0.305: U1.9 22.33,90.7 arc45 20.54,91.44 R15.2
!PAUSE  (via drill 0.6)
  Top 0.305: U2.17 56.14,79.11 arc45 57.04,78.74 v67.94,78.74
  Bottom 0.305: IC6.8 93.34,38.1 arc90 94.3,39.37 94.3,56.83 arc90 93.03,58.1 75.25,58.1 arc-90 73.03,60.33 73.03,77.47 arc90 71.75,78.74 v67.94,78.74
!PROGRAM
  Top 0.305: IC7.1 82.66,55.88 arc-45 83.56,55.51 84.08,54.98 arc45 84.98,54.61 93.66,54.61 arc-53 94.93,53.98 95.2,53.71 arc45 96.09,53.34 IC6.19
!RAM_CS  (via drill 0.6)
  Top 0.305: v18.41,52.7 arc90 19.32,53.61 IC4.6
  Bottom 0.305: IC7.18 83.19,50.8 arc90 81.92,49.53 81.92,43.18 arc-90 80.64,41.91 76.2,41.91 arc90 74.93,40.64 74.93,28.57 arc-90 73.66,27.3 19.68,27.3 arc-90 18.41,28.57 v18.41,52.7
!RD  (via drill 0.6)
  Top 0.305: v48.26,57.47 62.02,57.47 arc-90 64.77,54.72 v64.77,52.07 | IC14.12 122.87,62.55 arc90 122.56,62.23 122.56,60.96 arc-90 121.28,59.69 115.14,59.69 arc45 114.25,59.32 102.29,47.36 arc-45 101.39,46.99 92.71,46.99 arc-90 IC6.4 | v16.51,72.71 6.03,72.71 arc90 4.76,71.44 U4.11 4.76,33.97 | IC4.41 20.92,37.15 arc-90 19.65,35.88 15.45,35.88 arc45 14.55,35.51 10.79,31.75 arc-130 4.76,33.97 | DIS6.5 84.14,10.16 arc-90 85.41,8.89 85.41,3.49 arc90 86.68,2.22 114.94,2.22 arc90 116.2,3.49 116.2,18.41 arc90 115.25,19.68 arc-90 113.98,20.64 113.98,21.91 arc-90 114.94,23.18 118.43,23.18 arc90 121.28,26.04 121.28,26.35 arc-90 121.92,26.98 IC15.12 v135.25,26.99 | 4.76,33.97 4.76,11.43 arc90 6.03,10.16 DIS5.5
  Bottom 0.305: IC5.24 arc-90 58.42,40.01 58.42,49.64 arc-90 60.85,52.07 v64.77,52.07 87.31,52.07 arc-90 88.58,50.48 88.58,49.53 arc90 89.85,48.26 IC6.4 | v16.51,72.71 16.51,76.2 arc-90 17.78,77.47 26.04,77.47 arc-90 27.3,76.2 27.3,70.48 arc90 28.57,69.22 35.56,69.22 arc-90 38.1,66.67 38.1,58.74 arc90 39.37,57.47 v48.26,57.47 53.13,57.47 arc45 54.03,57.84 56.14,59.95 arc45 56.83,61.17 56.83,71.12 arc90 55.56,72.39 U2.20 | DIS6.5 80.54,10.16 arc-45 79.64,10.53 79.38,10.79 arc53 78.11,11.43 71.65,11.43 arc45 70.75,11.06 DIS7.5 68.95,11.06 arc45 68.05,11.43 58.95,11.43 arc45 58.05,11.06 DIS1.5 56.25,11.06 arc45 55.35,11.43 47.52,11.43 arc45 46.62,11.06 DIS2.5 44.82,11.06 arc45 43.92,11.43 36.09,11.43 arc45 35.19,11.06 DIS3.5 33.39,11.06 arc45 32.49,11.43 24.66,11.43 arc45 23.76,11.06 DIS4.5 21.96,11.06 arc45 21.06,11.43 13.23,11.43 arc45 12.33,11.06 DIS5.5 | v135.25,26.99 IC9.6
!RESET  (via drill 0.6)
  Top 0.305: 124.07,30.23 IC15.17 121.88,30.23 arc-45 v121.28,30.48 | U1.8 arc90 27.94,85.09 31.75,85.09 arc90 33.02,86.36 33.02,88.9 arc-90 36.2,92.08 38.47,92.08 arc45 38.92,92.26 39.82,93.16 arc-45 40.27,93.34 64.45,93.34 arc90 v65.72,94.61 | v121.28,65.72 arc-90 121.36,65.8 IC14.17 | U22.5 v110.49,21.27
  $VCC 0.305: v110.49,21.27 113.46,21.27 arc45 114.35,21.64 120.91,28.2 arc45 121.28,29.1 v121.28,30.48 v121.28,65.72
  Bottom 0.305: v65.72,94.61 65.99,94.35 arc45 66.88,93.98 81.28,93.98 arc-90 82.55,92.71 82.55,74.3 arc90 83.82,73.03 114.62,73.03 arc-90 115.89,71.75 115.89,66.99 arc90 117.16,65.72 v121.28,65.72
!RESET_REQ  (via drill 0.6)
  Top 0.305: U21.4 100.64,18.41 arc90 99.36,19.68 v98.42,19.68
  Bottom 0.305: v98.42,19.68 93.66,19.68 arc90 92.39,18.41 92.39,15.24 arc-90 91.12,13.97 73.03,13.97 arc-90 71.75,15.24 71.75,22.23 arc-90 72.39,22.86 76.2,22.86 arc90 77.47,24.13 77.47,30.48 arc-90 78.74,31.75 99.69,31.75 arc90 100.97,33.02 100.97,36.83 arc90 99.69,38.1 IC6.13
!RESIN  (via drill 0.6)
  Top 0.305: U22.2 100.33,23.81 arc-90 96.2,28.57 v96.2,33.02
  Bottom 0.305: v96.2,33.02 96.2,49.53 arc-90 97.16,50.8 IC6.18
!RTS0  (via drill 0.6)
  Top 0.305: v96.2,75.25 arc90 96.25,75.3 IC11.11
  Bottom 0.305: U1.45 45.35,66.94 arc-45 46.25,67.31 52.07,67.31 arc90 53.34,68.58 53.34,90.86 arc-45 53.53,91.31 58.23,96.02 arc-45 58.68,96.2 66.09,96.2 arc-45 67.63,95.57 arc45 68.39,95.25 81.92,95.25 arc-90 83.82,93.66 83.82,76.52 arc90 85.09,75.25 v96.2,75.25
!RUN  (via drill 0.6)
  Top 0.305: R7.1 102.55,15.61 arc90 103.55,14.61 105.96,14.61 arc90 106.96,15.61 SW3.3 | v101.92,58.74 98.79,58.74 arc-90 97.79,59.74 97.79,67.58 arc90 96.79,68.58 IC3.13
  $VCC 0.305: v101.92,58.74 arc90 100.65,57.47 100.65,18.78 arc90 101.65,17.78 105.77,17.78 arc-90 SW3.3
!RX_LED
  Top 0.305: IC11.22 93.66,86.05 arc90 93.03,86.68 83.82,86.68 arc-90 82.87,87.95 R3.1
!RXF  (via drill 0.6)
  Top 0.305: v106.05,85.72 arc-90 106.97,85.11 IC12.23 | IC6.7 arc-90 92.71,41.91 101.92,41.91 arc45 102.46,42.13 116.79,56.78 arc-45 117.68,57.15 127.87,57.15 arc90 130.18,59.45 v130.18,60.96
  Bottom 0.305: v106.05,85.72 106.05,75.56 arc90 106.68,74.93 116.63,74.93 arc-45 118.48,74.24 120.12,73.08 arc45 121.33,72.71 127.64,72.71 arc-90 128.91,71.44 128.91,64.14 arc53 129.54,62.87 129.99,62.42 arc-45 130.18,61.97 v130.18,60.96
!SS_REQ  (via drill 0.6)
  Top 0.305: IC3.8 94.61,62.23 arc-90 94.93,61.59 v94.93,58.42
  Bottom 0.305: v94.93,58.42 94.93,38.42 arc-90 IC6.9
!SS_WAIT_REQ  (via drill 0.6)
  Top 0.305: IC3.5 88.27,64.77 arc-90 90.49,62.55 v90.49,59.69
  Bottom 0.305: IC6.12 98.11,35.56 arc-90 96.84,36.83 96.84,48.26 arc-90 98.11,49.53 99.69,49.53 arc90 100.97,50.8 100.97,58.42 arc90 99.69,59.69 v90.49,59.69
!TX_LED
  Top 0.305: IC11.23 93,85.11 arc90 92.08,86.04 81.28,86.04 arc-90 80.01,87.31 R4.1
!TXE  (via drill 0.6)
  Top 0.305: v103.5,87 106.36,87 arc-90 107.62,85.72 IC12.22 | IC6.6 arc-90 92.71,44.45 101.39,44.45 arc45 102.29,44.82 115.52,58.05 arc-45 116.41,58.42 125.02,58.42 arc90 127,60.4 v127,60.96
  Bottom 0.305: v103.5,87 103.5,74.93 arc90 104.14,74.3 115.57,74.3 arc-90 117.16,73.03 117.16,72.07 arc90 118.11,70.8 126.36,70.8 arc-90 127.64,69.53 127.64,63.45 arc-45 127.45,63 127.19,62.73 arc45 127,62.28 v127,60.96
!USB_CS
  Bottom 0.305: IC7.16 IC6.5
!USB_RD  (via drill 0.6)
  Top 0.305: IC6.15 101.39,43.18 arc45 102.29,43.55 116.15,57.41 arc-45 117.05,57.78 126.05,57.78 arc90 128.59,60.33 v128.59,60.96 | v118.43,72.07 115.97,72.07 arc-90 IC12.13
  Bottom 0.305: v118.43,72.07 127.32,72.07 arc-90 128.27,70.8 128.27,61.28 arc90 v128.59,60.96
!USB_WR  (via drill 0.6)
  Top 0.305: IC6.16 101.39,45.72 arc45 102.29,46.09 114.88,58.68 arc-45 115.78,59.05 123.83,59.05 arc90 125.41,60.64 v125.41,60.96 | IC12.14 arc90 114.87,73.66 118.11,73.66 arc-90 119.38,72.07 119.38,70.64 arc-90 118.43,69.69 v117.79,69.69
  Bottom 0.305: v117.79,69.69 125.73,69.69 arc-90 127,68.42 127,64.77 arc-62 126.05,63.18 125.6,62.73 arc45 125.41,62.28 v125.41,60.96
!WAIT  (via drill 0.6)
  Top 0.305: v94.3,30.8 94.3,27.83 arc45 94.67,26.93 97.1,24.5 arc-45 97.47,23.6 97.47,23.18 arc-90 96.52,22.23 arc90 95.89,21.59 95.89,20.95 arc-90 95.25,20.32 94.3,20.32 arc90 93.03,19.05 93.03,6.35 arc-90 91.76,5.08 DIS6.8
  Bottom 0.305: U1.5 25.45,92.34 arc45 24.56,92.71 5.08,92.71 arc90 3.81,91.44 3.81,9.21 arc90 5.08,7.94 76.2,7.94 arc-90 77.47,6.67 DIS7.8 77.47,5.71 arc-90 78.74,6.99 87.63,6.99 arc-90 88.9,5.71 DIS6.8 | v94.3,30.8 100.65,30.8 arc90 101.92,32.07 101.92,38.53 arc45 101.55,39.42 101.28,39.69 arc-45 100.97,40.45 100.97,47.62 arc90 100.33,48.26 IC6.17
!WR  (via drill 0.6)
  Top 0.305: v66.04,54.61 66.04,46.13 arc-45 65.75,45.43 65.7,45.38 arc45 65.41,44.67 65.41,41.37 arc45 65.7,40.66 IC5.31 | IC6.3 90.81,50.8 arc90 89.53,49.53 89.53,40.64 arc90 90.81,39.37 v116.52,39.37 121.28,39.37 arc-90 IC9.40 | IC4.17 10.52,60.07 arc45 10.15,60.97 6.4,64.72 arc-45 6.03,65.61 U4.12 6.03,69.85 arc-90 7.3,71.12 17.14,71.12 arc90 18.41,72.39 18.41,73.66 arc-90 19.68,74.93 48.69,74.93 arc-45 49.58,74.56 50.11,74.03 arc45 51.01,73.66 v67.63,73.66 | v123.83,60.96 123.83,61.38 arc45 123.64,61.82 IC14.11 | IC15.11 122.17,26.34 arc90 121.92,26.08 121.92,25.4 arc-90 118.75,22.23 arc40 v115.25,20.95
  Bottom 0.305: IC6.3 90.17,50.8 arc-90 88.9,52.7 88.9,53.34 arc90 87.63,54.61 v66.04,54.61 66.88,55.45 arc45 67.63,57.25 v67.63,73.66 | v115.25,20.95 arc32 116.52,25.4 v116.52,39.37 116.52,57.47 arc-90 117.79,58.74 122.56,58.74 arc90 123.83,60.01 v123.83,60.96
!WR+E
  Top 0.305: U7.4 50.77,75.27 arc90 51.44,74.61 54.93,74.61 arc90 U2.19
!ZIORQ
  Top 0.305: U4.6 9.84,81.28 arc-90 11.11,82.55 40.01,82.55 arc90 40.64,83.19 40.64,86.41 arc-45 40.83,86.86 41.41,87.44 arc-45 41.86,87.63 43.81,87.63 arc-90 44.45,87 U1.62
!ZMREQ  (via drill 0.6)
  Top 0.305: v8.57,79.38 U4.7
  Bottom 0.305: U1.63 41.01,88 arc-45 40.11,87.63 39.37,87.63 arc90 38.1,86.36 arc-90 36.83,85.09 9.84,85.09 arc90 8.57,83.82 v8.57,79.38
!ZRD  (via drill 0.6)
  Top 0.305: v6.03,73.98 U4.9 | U3.1 42.55,55.67 arc-45 42.92,56.57 45.03,58.68 arc-45 45.29,59.05 v45.72,59.05
  Bottom 0.305: 43.18,81.28 43.18,88.9 arc90 41.91,90.17 38.63,90.17 arc45 37.73,89.8 U1.67 | 43.18,81.28 arc-90 41.91,80.01 16.19,80.01 arc90 14.92,78.74 14.92,75.25 arc-90 13.65,73.98 v6.03,73.98 | 43.18,81.28 43.18,60.33 arc90 44.45,59.05 v45.72,59.05
!ZWR  (via drill 0.6)
  Top 0.305: v7.3,78.11 U4.8 | U7.3 49.76,78.51 arc-90 48.58,79.69 48.58,83.82 arc90 47.31,85.09 46.35,85.09 arc-90 45.72,85.72 45.72,89.53 arc90 44.45,90.81 41.59,90.81 arc90 40.64,89.85 40.64,87.89 arc-45 40.45,87.44 U1.66
  Bottom 0.305: U1.66 39.37,83.82 arc-90 38.1,82.55 14.92,82.55 arc90 13.65,81.28 13.65,79.38 arc-90 12.38,78.11 v7.3,78.11
+3V3  (via drill 0.6, 0.9)
  Top 0.305: IC14.20 125.21,67.75 arc90 v125.81,68.58 | IC15.20 arc45 124.21,32.45 v125.09,33.34
  Top 0.61: C23.2 124.33,33.66 arc-45 v125.09,33.34 | C22.2 125.17,69.22 arc-90 v125.81,68.58 | C32.2 12.7,93.85 ESP-01S.8
  Top 0.813: 125.72,68.59 v125.81,68.58 | R21.2 v136.53,63.5 | R20.2 v136.53,60.96 | R23.2 v130.18,30.16 R22.2 | U5.4 U5.2 126.05,77.89 arc-45 125.3,76.09 | C29.1 arc-45 122.05,76.24 C30.2 123.17,75.56 arc-90 124.14,74.59
  Top 1.016: 125.3,76.09 124.92,75.71 arc45 124.14,74.59
  Top 1.27: 124.14,74.59 124.14,70.25 arc90 v125.81,68.58
  $VCC 0.813: v136.53,63.5 v136.53,60.96
  $VCC 1.016: v136.53,63.5 139.33,60.7 arc-45 140.02,58.21 140.02,39.9 arc-45 139.49,39 134.83,33.71 arc-45 133.94,33.34 132.92,33.34 | 132.92,33.34 v125.09,33.34 | v130.18,30.16 131.07,31.7 arc-45 132.92,33.34 | ESP-01S.8 ESP-01S.7 ESP-01S.6
  $VCC 1.778: v125.81,68.58 127,68.58 arc-90 128.27,67.31 128.27,64.77 arc90 129.54,63.5 v136.53,63.5 143.19,63.5 arc90 144.46,64.77 144.46,80.33 arc90 133.35,91.44 83.82,91.44 arc-90 80.96,93.98 80.96,95.89 arc90 79.06,97.79 21.27,97.79 arc90 20,96.52 20,92.71 arc-90 18.73,91.44 ESP-01S.8
ADDR0  (via drill 0.6)
  Top 0.305: IC5.12 58.79,47.25 arc-45 58.42,48.15 58.42,50.8 arc90 57.15,52.07 v48.26,52.07 48.07,52.07 arc45 47.31,51.75 47.04,51.49 arc-45 46.15,51.12 21.39,51.12 arc-90 20.12,52.39 IC4.5 20.12,55.76 arc90 19.05,56.83 18.62,56.83 arc-45 17.73,57.2 10.21,64.72 arc-45 9.84,65.61 U4.15 | v46.09,36.46 54.87,27.68 arc-45 55.24,26.78 55.24,16.51 arc90 56.52,15.24 DIS1.3 | IC9.10 132.72,43.18 arc-90 131.44,44.45 131.44,54.61 | v115.25,25.4 118.11,25.4 arc90 120.02,26.99 arc-90 121.31,28.29 IC15.14 | U2.21 v61.28,69.85 | v115.25,53.34 116.15,54.24 arc-45 117.05,54.61 131.44,54.61 | 131.44,54.61 131.44,61.44 arc90 130.81,62.07 127.16,62.07 arc-90 126.36,62.87 126.36,63.21 arc90 125.73,63.84 IC14.14
  Bottom 0.305: v46.09,36.46 45.46,37.09 arc-45 45.09,37.99 45.09,39.48 arc-45 45.46,40.38 47.89,42.81 arc45 48.26,43.71 v48.26,52.07 | v61.28,69.85 61.28,81.6 arc90 59.69,83.82 arc-90 58.42,85.41 58.42,92.08 arc-90 59.69,93.34 80.64,93.34 arc-90 81.92,92.08 81.92,73.66 arc90 83.19,72.39 113.98,72.39 arc-90 115.25,71.12 v115.25,53.34 v115.25,25.4 arc-59 112.71,23.5 101.6,23.5 arc90 100.01,21.91 100.01,20.64 arc-90 98.42,18.41 94.3,18.41 arc90 93.03,17.14 93.03,12.7 arc-90 91.76,11.43 80.54,11.43 arc-45 79.64,11.8 79.11,12.33 arc45 78.21,12.7 72.84,12.7 arc-45 72.07,13.02 71.49,13.6 arc45 70.59,13.97 58.95,13.97 arc-45 58.05,14.34 DIS1.3
ADDR1  (via drill 0.6)
  Top 0.305: IC5.11 59.69,51.75 arc90 58.42,53.02 v46.99,53.02 46.88,53.02 arc45 45.98,52.65 45.46,52.12 arc-45 44.56,51.75 22.19,51.75 arc-90 20.92,53.02 IC4.4 20.92,56.52 arc90 19.65,57.78 18.73,57.78 arc-45 18.19,58.01 11.48,64.72 arc-45 11.11,65.61 U4.16 | 122.92,28.93 IC15.15 121.56,28.93 arc-90 120.02,30.48 120.02,31.75 arc90 118.75,33.02 104.46,33.02 arc90 v103.19,31.43 | IC9.9 137.69,43.28 arc45 135.68,44.45 135.25,44.45 arc-90 133.99,45.72 133.99,61.44 arc90 132.72,62.71 127.64,62.71 arc-90 127,63.34 127,63.54 arc90 126.05,64.5 IC14.15 122.28,64.5 arc90 121.28,63.5 121.28,62.23 arc-90 120.02,60.96 113.87,60.96 arc45 112.98,60.59 104.51,52.12 arc-45 103.3,51.75 v102.23,51.75 | v73.03,21.91 69.11,21.91 arc45 68.53,21.54 67.22,20.23 arc45 66.99,19.68 66.99,15.24 arc-90 65.72,13.97 63.07,13.97 arc-45 62.18,14.34 59.11,17.41 arc45 58.21,17.78 DIS1.2 arc113 59.05,19.05 59.05,24.87 arc45 58.68,25.77 47.04,37.41 arc45 46.15,37.78 45.09,37.78 arc90 v44.13,36.51
  Bottom 0.305: v44.13,36.51 44.13,40.43 arc-45 44.5,41.33 46.62,43.44 arc45 46.99,44.34 v46.99,53.02 | v73.03,21.91 77.15,21.91 arc90 78.42,23.18 78.42,28.57 arc-90 79.69,29.84 101.28,29.84 arc90 v103.19,31.43 103.19,38.53 arc45 102.82,39.42 102.29,39.95 arc-45 101.92,40.85 101.92,51.44 arc-90 v102.23,51.75
ADDR2  (via drill 0.6)
  Top 0.305: IC5.10 61.33,47.25 arc-45 60.96,48.15 60.96,52.07 arc90 59.05,53.98 v45.72,53.98 arc53 44.45,53.34 43.87,52.76 arc-45 42.97,52.39 22.99,52.39 arc-90 21.72,53.66 IC4.3 21.72,57.47 arc90 20.45,58.74 19.26,58.74 arc-45 18.36,59.11 12.75,64.72 arc-45 12.38,65.61 U4.17 | DIS1.13 64.66,17.78 arc-45 63.76,18.15 60.7,21.22 arc-45 60.33,22.12 60.33,26.78 arc45 59.95,27.68 47.04,40.59 arc45 46.15,40.96 44.45,40.96 arc90 43.18,39.69 43.18,37.47 arc-90 v42.23,36.51
  Bottom 0.305: v45.72,53.98 45.72,44.98 arc-45 45.35,44.08 42.6,41.33 arc45 42.23,40.43 v42.23,36.51
ADDR3  (via drill 0.6)
  Top 0.305: DIS1.12 60.06,19.95 arc-45 59.69,20.85 59.69,25.83 arc45 59.32,26.72 v46.46,39.69 | IC5.9 62.23,52.39 arc90 59.69,54.93 v48.26,54.93 | v29.21,54.93 arc-90 27.3,53.02 24.43,53.02 arc-90 22.52,54.29 IC4.2 22.52,58.42 arc90 21.25,59.69 19.58,59.69 arc-45 18.68,60.06 14.02,64.72 arc-45 13.65,65.61 U4.18
  Bottom 0.305: v46.46,39.69 49.16,42.06 arc45 49.53,42.96 49.53,53.66 arc90 v48.26,54.93 v29.21,54.93
ADDR4  (via drill 0.6)
  Top 0.305: IC5.8 63.87,47.25 arc-45 63.5,48.15 63.5,53.66 arc90 60.96,56.2 v50.16,56.2 | DIS2.3 46.35,15.24 arc90 47.62,16.51 47.62,28.68 arc45 47.25,29.58 v40.32,36.51 | IC4.1 arc90 24.24,53.66 25.4,53.66 arc90 v27.94,55.88
  Bottom 0.305: 34.29,56.2 v50.16,56.2 | v40.32,36.51 28.31,48.52 arc-45 27.94,49.42 v27.94,55.88 arc-90 28.57,56.2 34.29,56.2 | U1.19 24.77,76.2 arc-90 26.04,74.93 26.04,69.22 arc90 27.3,67.94 34.29,67.94 arc-90 35.56,66.67 35.56,57.47 arc-90 34.29,56.2
ADDR5  (via drill 0.6)
  Top 0.305: v27.62,34.92 15.77,34.92 arc45 14.87,34.55 9.9,29.58 arc-45 9,29.21 v5.71,29.21 | DIS2.2 45.09,17.78 arc-90 43.81,19.05 43.81,29.95 arc45 43.44,30.85 v39.37,34.92 | IC4.22 arc-90 5.71,56.02 v5.71,59.69
  Bottom 0.305: v5.71,29.21 v5.71,59.69 5.71,71.12 arc-90 6.35,71.75 16.94,71.75 arc45 17.83,72.13 19,73.29 arc-45 19.89,73.66 U1.20 | v27.62,34.92 v39.37,34.92 | v39.37,34.92 62.23,34.92 arc90 63.5,36.2 63.5,47.1 arc-45 63.87,48 IC5.7 | v39.37,34.92 42.55,34.92
ADDR6  (via drill 0.6)
  Top 0.305: v34.29,32.38 15.77,32.38 arc45 14.87,32.01 9.9,27.04 arc-45 9,26.67 v6.67,26.67 | DIS2.13 52.7,17.78 arc-90 51.44,19.05 51.44,28.68 arc45 51.06,29.58 v48.26,32.38 | IC4.21 7.32,56.49 arc90 v6.67,57.15
  Bottom 0.305: U1.21 23.23,72.76 arc-45 22.33,72.39 20.21,72.39 arc45 19.31,72.02 18.47,71.17 arc-45 17.57,70.8 7.3,70.8 arc90 6.67,70.17 v6.67,57.15 v6.67,26.67 | IC5.6 68.21,45.46 arc45 69.11,45.09 69.85,45.09 arc-90 71.12,43.81 71.12,33.66 arc-90 69.85,32.38 v48.26,32.38 v34.29,32.38
ADDR7  (via drill 0.6)
  Top 0.305: v31.11,33.66 15.77,33.66 arc45 14.87,33.28 9.9,28.31 arc-45 9,27.94 v7.62,27.94 | DIS2.12 50.8,15.24 arc-90 49.53,16.51 49.53,28.68 arc45 49.16,29.58 v45.09,33.66 | IC4.20 8.12,56.97 arc90 7.62,57.47 v7.62,58.74
  Bottom 0.305: v7.62,27.94 v7.62,58.74 7.62,69.22 arc-90 8.26,69.85 18.1,69.85 arc53 19.37,70.48 19.63,70.75 arc-45 20.53,71.12 U1.22 | IC5.5 66.41,48 arc45 66.04,47.1 66.04,35.56 arc-90 64.77,33.66 v45.09,33.66 v31.11,33.66
ADDR8  (via drill 0.6)
  Top 0.305: IC5.27 64.77,26.04 arc90 66.04,24.77 arc-90 67.63,23.18 v67.63,22.54 | IC4.19 8.92,57.44 arc90 8.57,57.78 v8.57,60.33
  Bottom 0.305: U1.23 23.23,70.22 arc-45 22.33,69.85 21.16,69.85 arc45 20.27,69.48 20,69.22 arc-45 19.24,68.9 8.89,68.9 arc90 8.57,68.58 v8.57,60.33 8.57,18.41 arc90 10.48,16.51 34.29,16.51 | 34.29,16.51 65.41,16.51 arc90 67.63,18.73 v67.63,22.54 | DIS3.3 34.29,16.51
ADDR9  (via drill 0.6)
  Top 0.305: v65.41,22.86 arc-90 63.5,24.77 63.5,35.99 arc50 IC5.26 | IC4.18 9.72,57.94 arc45 v9.53,58.74
  Bottom 0.305: 34.29,19.05 10.79,19.05 arc-90 9.53,20.32 v9.53,58.74 9.53,67.31 arc-90 10.16,67.94 20.95,67.94 arc90 U1.24 | 34.29,19.05 65.41,19.05 arc90 66.67,20.32 66.67,21.59 arc90 v65.41,22.86 | DIS3.2 34.29,19.05
ADDR10  (via drill 0.6)
  Top 0.305: DIS3.13 40.64,17.78 arc-90 39.37,19.05 v39.37,21.59 | IC5.23 60.59,35.3 arc-45 60.96,34.4 60.96,23.39 arc45 61.33,22.49 v62.23,21.59 | IC4.23 6.52,39.41 arc45 6.89,38.51 v10.79,34.61
  Bottom 0.305: U1.25 23.23,67.68 arc-45 22.33,67.31 12.06,67.31 arc90 10.79,66.04 v10.79,34.61 10.79,22.86 arc90 12.06,21.59 v39.37,21.59 v62.23,21.59
ADDR11  (via drill 0.6)
  Top 0.305: IC5.25 62.23,23.5 arc90 v63.18,22.86 | DIS3.12 38.1,15.24 arc-90 36.83,16.51 v36.83,22.86 | IC4.24 7.32,41.15 arc45 7.69,40.25 v11.75,36.2
  Bottom 0.305: U1.26 13.02,66.04 arc90 11.75,64.77 v11.75,36.2 11.75,24.13 arc90 13.02,22.86 v36.83,22.86 v63.18,22.86
ADDR12  (via drill 0.6)
  Top 0.305: DIS4.3 25.4,15.24 arc90 26.67,16.51 26.67,22.02 arc-45 27.04,22.91 27.3,23.18 arc45 27.62,23.94 v27.62,24.77 v27.62,31.11 | v13.65,49.53 9.39,49.53 arc90 8.12,48.26 IC4.25
  Bottom 0.305: U1.27 14.92,63.5 arc90 13.65,62.23 v13.65,49.53 13.65,26.04 arc90 14.92,24.77 v27.62,24.77 | v27.62,31.11 70.48,31.11 arc90 71.75,32.38 71.75,45.09 arc90 70.48,46.35 IC5.4
ADDR13  (via drill 0.6)
  Top 0.305: IC7.9 78.48,35.3 arc-45 77.58,34.92 67.31,34.92 arc-90 66.04,35.88 arc32 IC5.28 | DIS4.2 24.13,17.78 arc90 25.4,19.05 25.4,22.97 arc-45 25.77,23.55 v26.04,23.81 | IC4.26 8.92,42.09 arc45 9.29,41.19 v12.7,37.78
  Bottom 0.305: U1.28 23.23,65.14 arc-45 22.33,64.77 13.97,64.77 arc90 12.7,63.5 v12.7,37.78 12.7,25.08 arc90 13.97,23.81 v26.04,23.81 75.56,23.81 arc90 76.83,25.08 76.83,34.29 arc-90 78.42,35.56 IC7.9
ADDR14  (via drill 0.6)
  Top 0.305: IC5.29 76.31,36.2 arc45 77.21,36.57 IC7.8 | DIS4.13 31.11,17.78 arc90 32.38,19.05 v32.38,24.77 | IC4.27 9.72,42.87 arc45 10.09,41.98 14.23,37.84 arc45 15.13,37.47 v16.19,37.47
  Bottom 0.305: U1.29 arc-90 25.08,61.59 17.46,61.59 arc90 16.19,60.33 v16.19,37.47 16.19,26.99 arc90 17.46,25.72 28.31,25.72 arc-45 28.76,25.53 29.34,24.95 arc45 29.79,24.77 v32.38,24.77 74.93,24.77 arc90 76.2,26.04 76.2,36.83 arc-90 77.79,38.1 IC7.8
ADDR15  (via drill 0.6)
  Top 0.305: DIS4.12 29.21,15.24 arc-90 27.94,16.51 27.94,21.59 arc-90 29.21,22.86 arc90 30.48,24.13 v30.48,25.72 | IC7.7 80.64,40.64 arc90 81.92,41.91 81.92,46.04 arc90 81.28,46.99 73.03,46.99 arc90 72.07,46.04 arc-90 71.12,45.09 68.99,45.09 arc45 68.29,44.79 IC5.3 | IC4.28 10.52,43.34 arc45 10.89,42.45 13.92,39.42 arc45 14.81,39.05 v17.14,39.05
  Bottom 0.305: U1.30 27.57,65.14 arc-45 27.94,64.24 27.94,62.23 arc-90 26.67,60.96 18.41,60.96 arc90 17.14,59.69 v17.14,39.05 17.14,27.62 arc90 18.1,26.67 29.53,26.67 arc-90 v30.48,25.72 74.3,25.72 arc90 75.56,26.99 75.56,39.37 arc-90 77.15,40.64 IC7.7
ADDR16  (via drill 0.6)
  Top 0.305: v19.68,31.11 16.4,31.11 arc45 15.5,30.74 5.77,21.01 arc45 5.4,20.11 5.4,16.51 arc90 6.67,15.24 DIS5.3 | IC4.39 19.32,42.82 arc-90 18.73,42.23 arc152 18.41,40.96 19.31,40.06 arc-45 19.68,39.16 v19.68,37.47 | IC7.6 78.11,43.18 arc-90 76.83,44.45 arc90 75.56,45.72 73.66,45.72 arc90 72.39,44.45 arc-90 71.75,43.81 IC5.2
  Bottom 0.305: IC7.6 75.56,43.18 arc90 74.3,41.91 74.3,29.21 arc-90 73.03,27.94 20.32,27.94 arc-90 19.68,28.57 v19.68,31.11 v19.68,37.47 19.68,38.47 arc-45 19.87,38.92 20.45,39.5 arc45 20.64,39.95 20.64,59.05 arc-90 21.91,60.33 28.57,60.33 arc90 29.21,60.96 U1.31
ADDR17  (via drill 0.6)
  Top 0.305: v22.23,31.11 22.23,31.01 arc-45 21.85,30.11 15.93,24.18 arc45 15.56,23.29 15.56,19.05 arc-90 14.29,17.78 DIS5.2 | IC4.42 21.72,37.22 arc45 22.09,36.33 v22.23,36.2 | IC7.5 80.33,45.72 arc-90 80.96,45.09 80.96,42.55 arc-90 80.33,41.91 76.2,41.91 arc90 74.93,40.64 74.93,40.01 arc-90 73.66,38.73 69.53,38.73
  Bottom 0.305: IC7.5 74.93,45.72 arc90 73.66,44.45 73.66,29.84 arc-90 72.39,28.57 22.86,28.57 arc-90 22.23,29.21 v22.23,31.11 v22.23,36.2 22.23,58.42 arc-90 23.5,59.69 29.21,59.69 arc90 30.48,60.96 30.48,64.24 arc45 30.11,65.14 U1.32
ADDR18  (via drill 0.6)
  Top 0.305: DIS5.13 18.41,17.78 arc-90 17.14,19.05 17.14,22.97 arc-45 17.52,23.87 23.44,29.79 arc45 23.81,30.69 v23.81,31.11 | IC4.43 22.52,38.96 arc45 22.89,38.07 v23.81,37.15 | IC7.4 69.85,48.26 arc90 68.58,46.99 68.58,46.35 arc-90 67.31,45.09 arc103 66.04,43.5 arc28 67.63,40.96
  Bottom 0.305: IC7.4 74.3,48.26 arc90 73.03,46.99 73.03,30.48 arc-90 71.75,29.21 24.77,29.21 arc-90 23.81,30.48 v23.81,31.11 v23.81,37.15 23.81,57.78 arc-90 25.08,59.05 30.48,59.05 arc90 31.75,60.33 U1.33
ADDR19  (via drill 0.6)
  Top 0.305: DIS5.12 arc90 20.95,17.14 20.95,22.97 arc-45 21.33,23.87 25.03,27.57 arc45 25.4,28.47 v25.4,31.11 | IC4.44 23.32,40.7 arc45 23.69,39.81 v25.4,38.1
  Bottom 0.305: IC7.3 73.66,50.8 arc90 72.39,49.53 72.39,31.11 arc-90 71.12,29.84 26.35,29.84 arc-90 v25.4,31.11 v25.4,38.1 25.4,55.88 arc-90 26.67,57.15 33.02,57.15 arc90 34.29,58.42 U1.35
BREAK  (via drill 0.6)
  Top 0.305: IC3.11 95.89,66.04 arc-90 96.52,65.09 v96.52,56.83
  Bottom 0.305: v96.52,56.83 arc45 95.57,55.75 95.57,36.83 arc-90 92.08,34.29 88.47,34.29 arc-45 87.58,34.66 IC7.12
DA0
  Bottom 0.203: IDE.35 arc-90 142,22.67 142,26.78 arc45 141.63,27.6 139.91,29.31 arc-45 139.54,30.21 139.54,49.53 arc90 138.27,50.8 IC9.15
DA1
  Bottom 0.203: IDE.33 arc-90 142.56,24.12 142.56,26.94 arc45 142.34,27.76 142.29,27.81 arc-45 142.08,28.39 142.08,54.61 arc90 140.81,55.88 IC9.18
DA2
  Bottom 0.203: IDE.36 145.26,20.37 arc-45 144.36,20 142.72,20 arc-90 141.45,21.35 141.45,26.46 arc45 141.07,27.36 139.44,29 arc-45 139.06,29.89 139.06,46.99 arc90 IC9.13
DATA0  (via drill 0.6)
  Top 0.305: IC5.13 53.23,48.9 arc-45 52.33,49.27 51.17,50.11 arc45 50.27,50.48 32.38,50.48 arc90 31.11,49.21 U3.11 30.48,44.86 arc-90 29.21,46.13 29.21,49.21 arc90 27.94,50.48 18.19,50.48 arc-90 16.92,51.75 IC4.9 | IC15.1 105.41,32.19 arc90 104.14,30.91 v104.46,30.8 | IC14.1 106.36,67.75 arc90 104.78,66.16 104.78,63.18 arc-90 103.82,62.23 v99.69,62.23 99.69,68.69 arc-45 100.07,69.59 103.35,72.87 arc45 103.72,74.41 IC12.1 | IC9.38 121.66,42.28 arc-45 120.76,41.91 v104.46,41.91
  Bottom 0.305: 56.89,48.9 IC5.13 57.15,50.27 arc-45 57.52,51.17 66.3,59.95 arc45 66.67,61.17 66.67,78.74 arc-90 67.94,80.01 U2.8 73.66,80.01 arc-90 74.93,78.74 74.93,63.5 arc90 76.2,62.23 v99.69,62.23 103.19,62.23 arc-90 104.46,60.64 v104.46,41.91 v104.46,30.8 arc-90 102.87,29.21 80.64,29.21 arc90 79.38,27.94 79.38,16.51 arc90 80.64,15.24 DIS6.3
DATA1  (via drill 0.6)
  Top 0.305: IC15.2 106.68,31.54 arc90 105.41,30.27 v105.73,30.16 | IC14.2 107,67.09 arc90 105.73,65.83 v105.73,58.74 | IC9.37 v105.73,43.18 | IC12.5 106.33,71.61 arc-45 105.95,70.71 103.56,68.32 arc45 102.55,66.47 v102.55,63.18 | IC4.10 16.12,51.12 arc90 17.39,49.85 27.3,49.85 arc-90 28.57,48.58 28.57,44.45 arc90 29.84,43.18 31.11,43.18 arc90 32.38,44.45 U3.12 32.38,48.58 arc-90 33.66,49.85 49,49.85 arc-45 49.9,49.48 52.65,46.73 arc45 53.55,46.35 IC5.14
  Bottom 0.305: IC5.14 54.35,46.62 arc-45 53.98,47.52 53.98,48.37 arc-45 54.35,49.27 65.67,60.59 arc45 66.04,61.8 66.04,81.28 arc-90 67.94,82.55 U2.9 74.3,82.55 arc-90 75.56,81.28 75.56,64.14 arc90 76.52,63.18 v102.55,63.18 104.46,63.18 arc-90 105.73,61.91 v105.73,58.74 v105.73,43.18 v105.73,30.16 arc-90 104.46,28.57 85.09,28.57 arc90 83.82,27.3 83.82,19.05 arc-90 82.55,17.78 DIS6.2
DATA2  (via drill 0.6)
  Top 0.305: IC5.15 56.25,45.46 arc-45 55.35,45.09 52.7,45.09 48.95,48.84 arc45 48.05,49.21 34.92,49.21 arc90 33.66,47.94 U3.13 33.66,43.81 arc-90 32.38,42.55 29.21,42.55 arc-90 27.94,43.81 27.94,47.62 arc90 26.67,49.21 16.51,49.21 arc-90 15.24,50.48 15.24,51.75 arc90 14.61,52.39 14.29,52.39 arc-90 13.72,52.95 IC4.13 | IC15.3 107.63,30.89 arc90 106.68,29.61 v107,29.53 | IC14.3 108.27,66.44 arc90 107,65.17 v107,59.69 | IC9.36 121.66,44.82 arc-45 120.76,44.45 v107,44.45 | IC12.3 105.03,71.58 arc-45 104.65,70.68 101.65,67.68 arc45 101.28,66.78 v101.28,64.14
  Bottom 0.305: IC5.15 56.25,45.46 arc-45 55.35,45.09 53.98,45.09 arc-90 53.34,45.72 53.34,49 arc-45 53.71,49.9 65.03,61.22 arc45 65.41,62.12 65.41,83.82 arc-90 66.67,85.09 U2.10 74.93,85.09 arc-90 76.2,83.82 76.2,65.72 arc90 77.79,64.14 v101.28,64.14 105.73,64.14 arc-90 107,62.87 v107,59.69 v107,44.45 v107,29.53 arc-90 105.41,27.94 87.63,27.94 arc90 86.36,26.67 86.36,18.41 arc90 87,17.78 DIS6.13
DATA3  (via drill 0.6)
  Top 0.305: IC5.17 56.25,42.92 arc-45 55.35,42.55 53.66,42.55 48,48.21 arc45 47.1,48.58 36.2,48.58 arc90 34.92,47.31 U3.14 34.92,43.18 arc-90 33.66,41.91 28.57,41.91 arc-90 27.3,43.18 27.3,47.31 arc90 26.04,48.58 15.88,48.58 arc-90 14.61,49.85 14.61,51.12 arc90 13.97,51.75 arc-90 12.92,52.8 IC4.14 | IC15.4 109.22,30.23 arc90 107.95,28.96 v108.27,28.89 | IC14.4 109.54,65.8 arc90 108.27,64.53 v108.27,60.64 | IC12.11 110.22,73.67 arc45 110.49,73.03 110.75,72.76 arc-45 111.12,71.86 111.12,69.85 arc-90 109.86,68.58 105.73,68.58 arc90 103.82,66.04 v103.82,65.09 | IC9.35 v108.27,45.72
  Bottom 0.305: IC5.17 56.25,42.92 arc-45 55.35,42.55 53.98,42.55 arc-90 52.7,43.81 52.7,49.64 arc-45 53.08,50.54 64.4,61.86 arc45 64.77,62.76 64.77,86.36 arc-90 66.04,87.63 U2.11 75.56,87.63 arc-90 76.83,86.36 76.83,66.36 arc90 78.11,65.09 v103.82,65.09 107,65.09 arc-90 108.27,63.82 v108.27,60.64 v108.27,45.72 v108.27,28.89 arc-90 106.68,27.3 92.08,27.3 arc90 90.81,26.04 90.81,16.51 arc-90 89.53,15.24 DIS6.12
DATA4  (via drill 0.6)
  Top 0.305: IC5.18 53.34,41.27 47.04,47.57 arc45 46.15,47.94 37.47,47.94 arc90 36.2,46.67 U3.15 36.2,42.55 arc-90 34.92,41.27 27.94,41.27 arc-90 26.67,42.55 26.67,46.67 arc90 25.4,47.94 14.19,47.94 arc90 12.92,46.67 IC4.31 | IC15.5 111.44,29.59 arc90 110.17,28.32 v110.17,27.94 | IC14.5 111.44,65.14 arc90 110.17,63.88 v110.17,61.59 | IC9.33 v110.17,48.26 | v92.39,21.27 92.39,15.24 arc-90 91.12,13.97 73.34,13.97 arc-32 DIS7.3 | IC12.2 104.38,72.52 arc-45 104,71.62 v100.97,68.58
  Bottom 0.305: IC5.18 53.34,41.27 arc-90 52.07,42.55 52.07,50.27 arc-45 52.44,51.17 63.76,62.49 arc45 64.14,63.39 64.14,88.9 arc-90 65.41,90.17 U2.12 78.11,90.17 arc-90 79.38,88.9 79.38,69.85 arc90 80.33,68.58 v100.97,68.58 108.58,68.58 arc-90 110.17,67.31 v110.17,61.59 v110.17,48.26 v110.17,27.94 arc-90 108.27,26.04 93.66,26.04 arc90 92.39,24.77 v92.39,21.27
DATA5  (via drill 0.6)
  Top 0.305: IC5.19 56.25,40.38 arc-45 55.35,40.01 53.02,40.01 46.09,46.94 arc45 45.19,47.31 38.1,47.31 arc90 37.47,46.67 U3.16 37.47,41.91 arc-90 36.2,40.64 27.3,40.64 arc-90 26.04,41.91 26.04,46.04 arc90 24.77,47.31 14.99,47.31 arc90 13.72,46.04 IC4.32 | v62.23,90.17 U2.13 | IC15.6 112.71,28.93 arc90 111.44,27.66 v111.44,27.3 | IC14.6 112.71,64.5 arc90 111.44,63.23 v111.44,62.55 | IC9.32 121.66,49.9 arc-45 120.76,49.53 v111.44,49.53 | v93.98,24.45 75.56,24.45 arc90 74.3,23.18 74.3,19.05 arc-90 72.71,17.78 DIS7.2 | IC12.9 108.92,71.99 arc-45 108.55,71.09 v107,69.53
  Bottom 0.305: IC5.19 56.25,40.38 arc-45 55.35,40.01 52.7,40.01 arc-90 51.44,41.27 51.44,50.91 arc-45 51.81,51.81 63.13,63.13 arc45 63.5,64.03 63.5,89.22 arc90 v62.23,90.17 arc-90 63.5,91.44 78.74,91.44 arc-90 80.01,90.17 80.01,70.8 arc90 81.28,69.53 v107,69.53 110.17,69.53 arc-90 111.44,68.26 v111.44,62.55 v111.44,49.53 v111.44,27.3 arc-90 109.86,25.4 94.61,25.4 arc90 v93.98,24.45
DATA6  (via drill 0.6)
  Top 0.305: IC5.20 53.23,38.73 arc-45 52.33,39.11 45.14,46.3 arc45 44.24,46.67 39.37,46.67 arc90 38.73,46.04 U3.17 38.73,41.27 arc-90 37.47,40.01 26.67,40.01 arc-90 25.4,41.27 25.4,45.09 arc90 24.13,46.67 17.39,46.67 arc90 16.12,45.4 IC4.35 | v61.28,87.63 U2.14 | IC15.7 113.98,28.29 arc90 112.71,27.02 v112.71,26.67 | IC14.7 113.98,63.84 arc90 112.71,62.58 v112.71,61.91 | IC12.10 109.58,70.45 arc90 v109.86,70.48 | IC9.31 v112.71,50.8 | v94.93,22.23 77.47,22.23 arc106 75.56,20.32 75.56,18.41 arc90 76.2,17.78 DIS7.13
  Bottom 0.305: IC5.20 52.07,38.73 arc-90 50.8,40.01 50.8,51.54 arc-45 51.17,52.44 62.49,63.76 arc45 62.87,64.66 62.87,86.68 arc90 v61.28,87.63 arc-90 60.96,88.27 60.96,90.81 arc-90 62.23,92.08 79.38,92.08 arc-90 80.64,90.81 80.64,71.75 arc90 81.92,70.48 v109.86,70.48 111.44,70.48 arc-90 112.71,69.22 v112.71,61.91 v112.71,50.8 v112.71,26.67 arc-90 110.49,24.77 96.2,24.77 arc90 94.93,23.5 v94.93,22.23
DATA7  (via drill 0.6)
  Top 0.305: U3.18 40.01,40.64 arc-90 38.73,39.37 | 38.73,39.37 26.04,39.37 arc-90 24.77,40.64 24.77,44.77 arc90 23.5,46.04 18.19,46.04 arc90 16.92,44.77 IC4.36 | IC5.21 53.55,36.2 arc-45 52.97,36.57 48,41.54 arc45 47.1,41.91 43.18,41.91 arc90 42.23,40.96 42.23,40.32 arc-90 41.27,39.37 38.73,39.37 | v61.28,85.09 U2.15 | IC15.8 115.25,27.64 arc90 113.98,26.36 v113.98,26.04 | IC14.8 114.63,63.2 arc90 v113.98,62.55 | IC12.6 106.97,71.78 arc90 v107.31,71.44 | IC9.30 121.66,52.44 arc-45 120.76,52.07 v113.98,52.07 | v96.2,23.18 76.2,23.18 arc90 74.93,21.91 74.93,16.83 arc90 76.2,15.24 DIS7.12